# Altium project ATLAS_XP2V5.2016.11.14.PrjPcb (part 1 of 2)
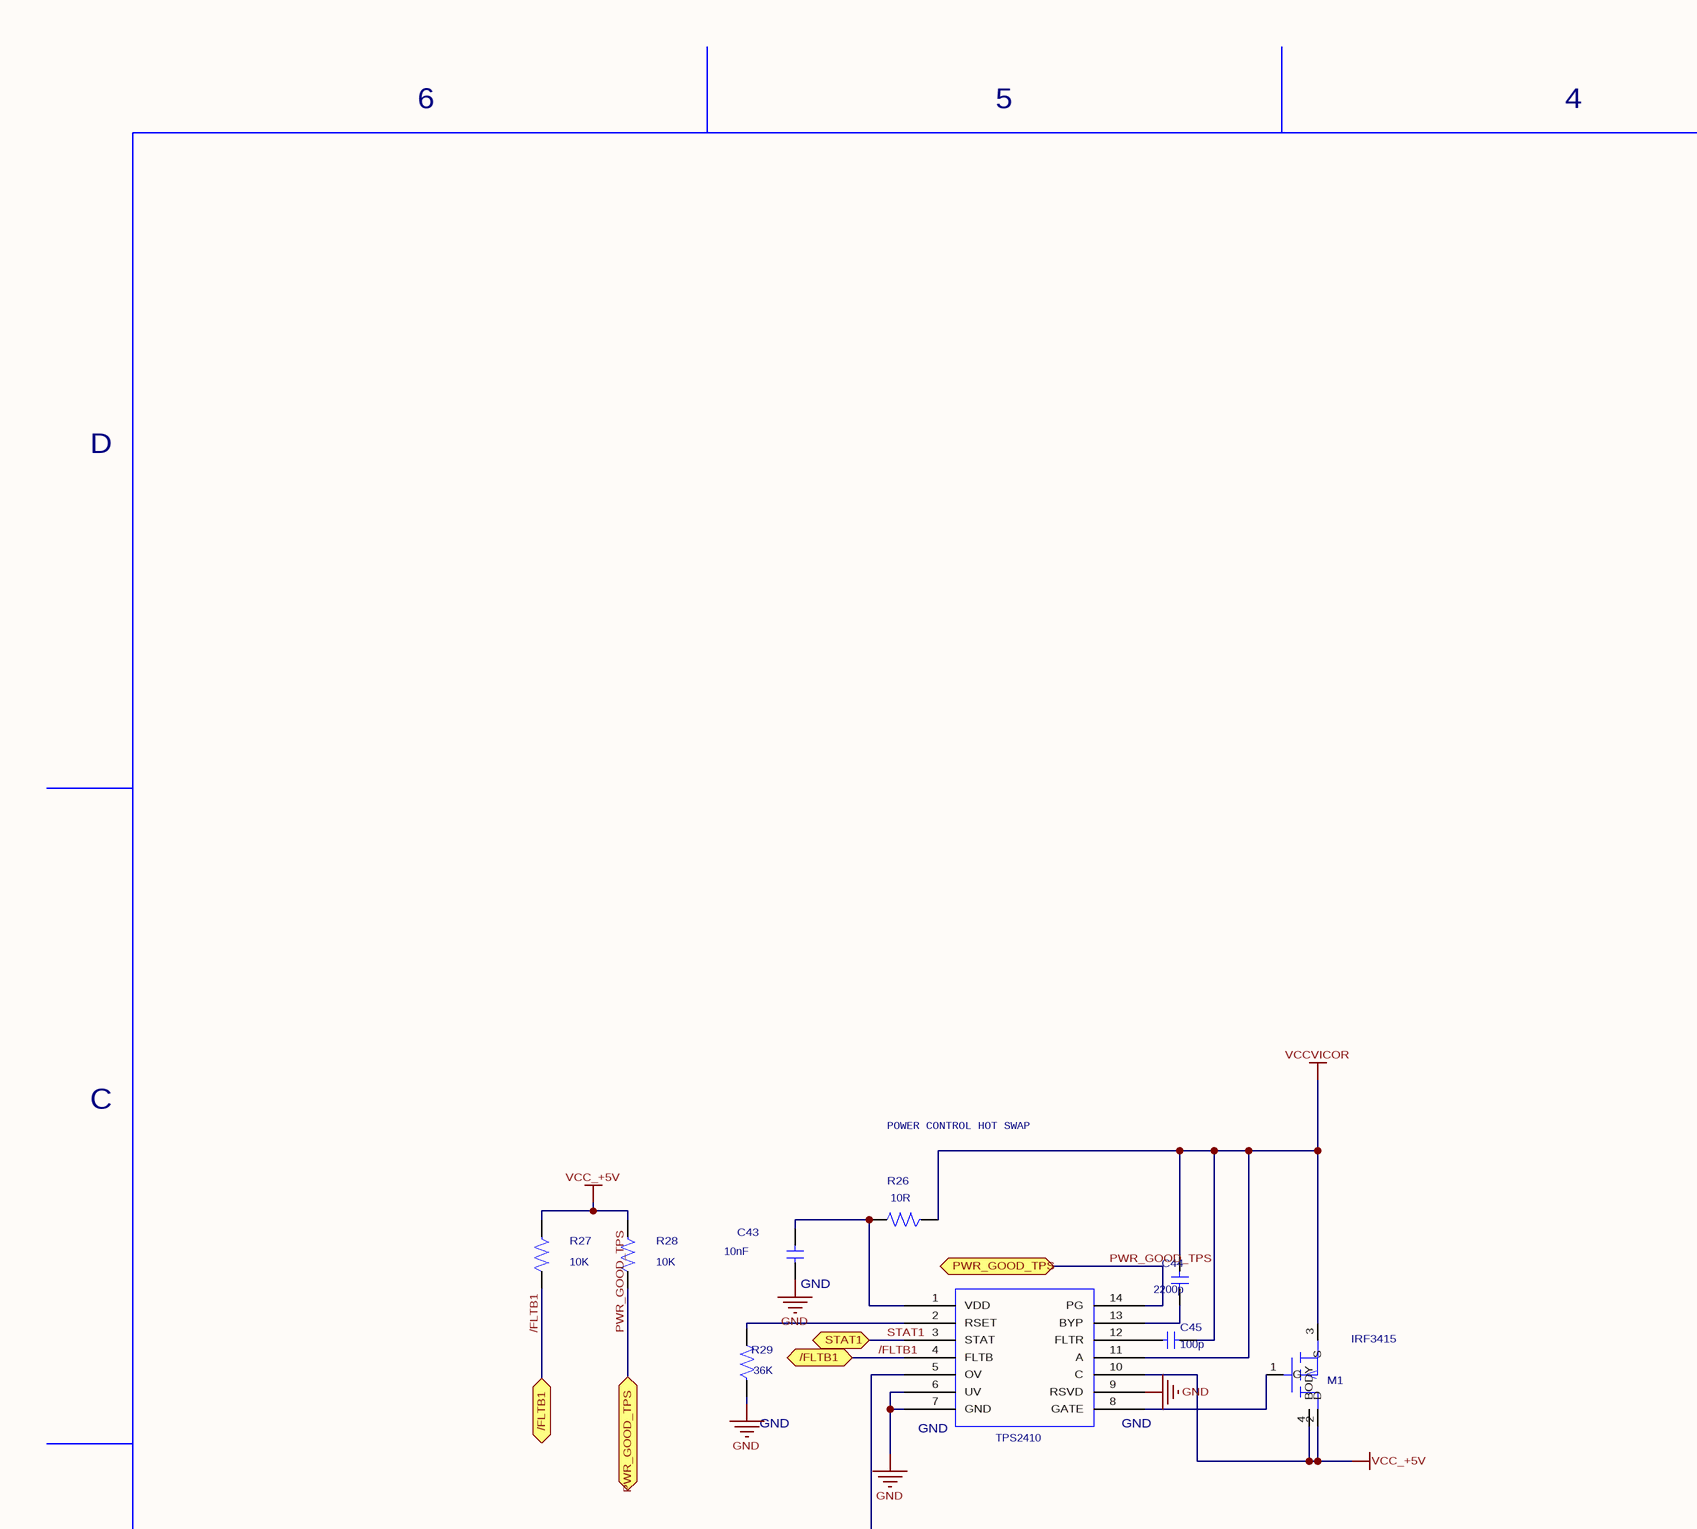
[diagram p0: POWER_SUPPLY.SchDoc, top left]
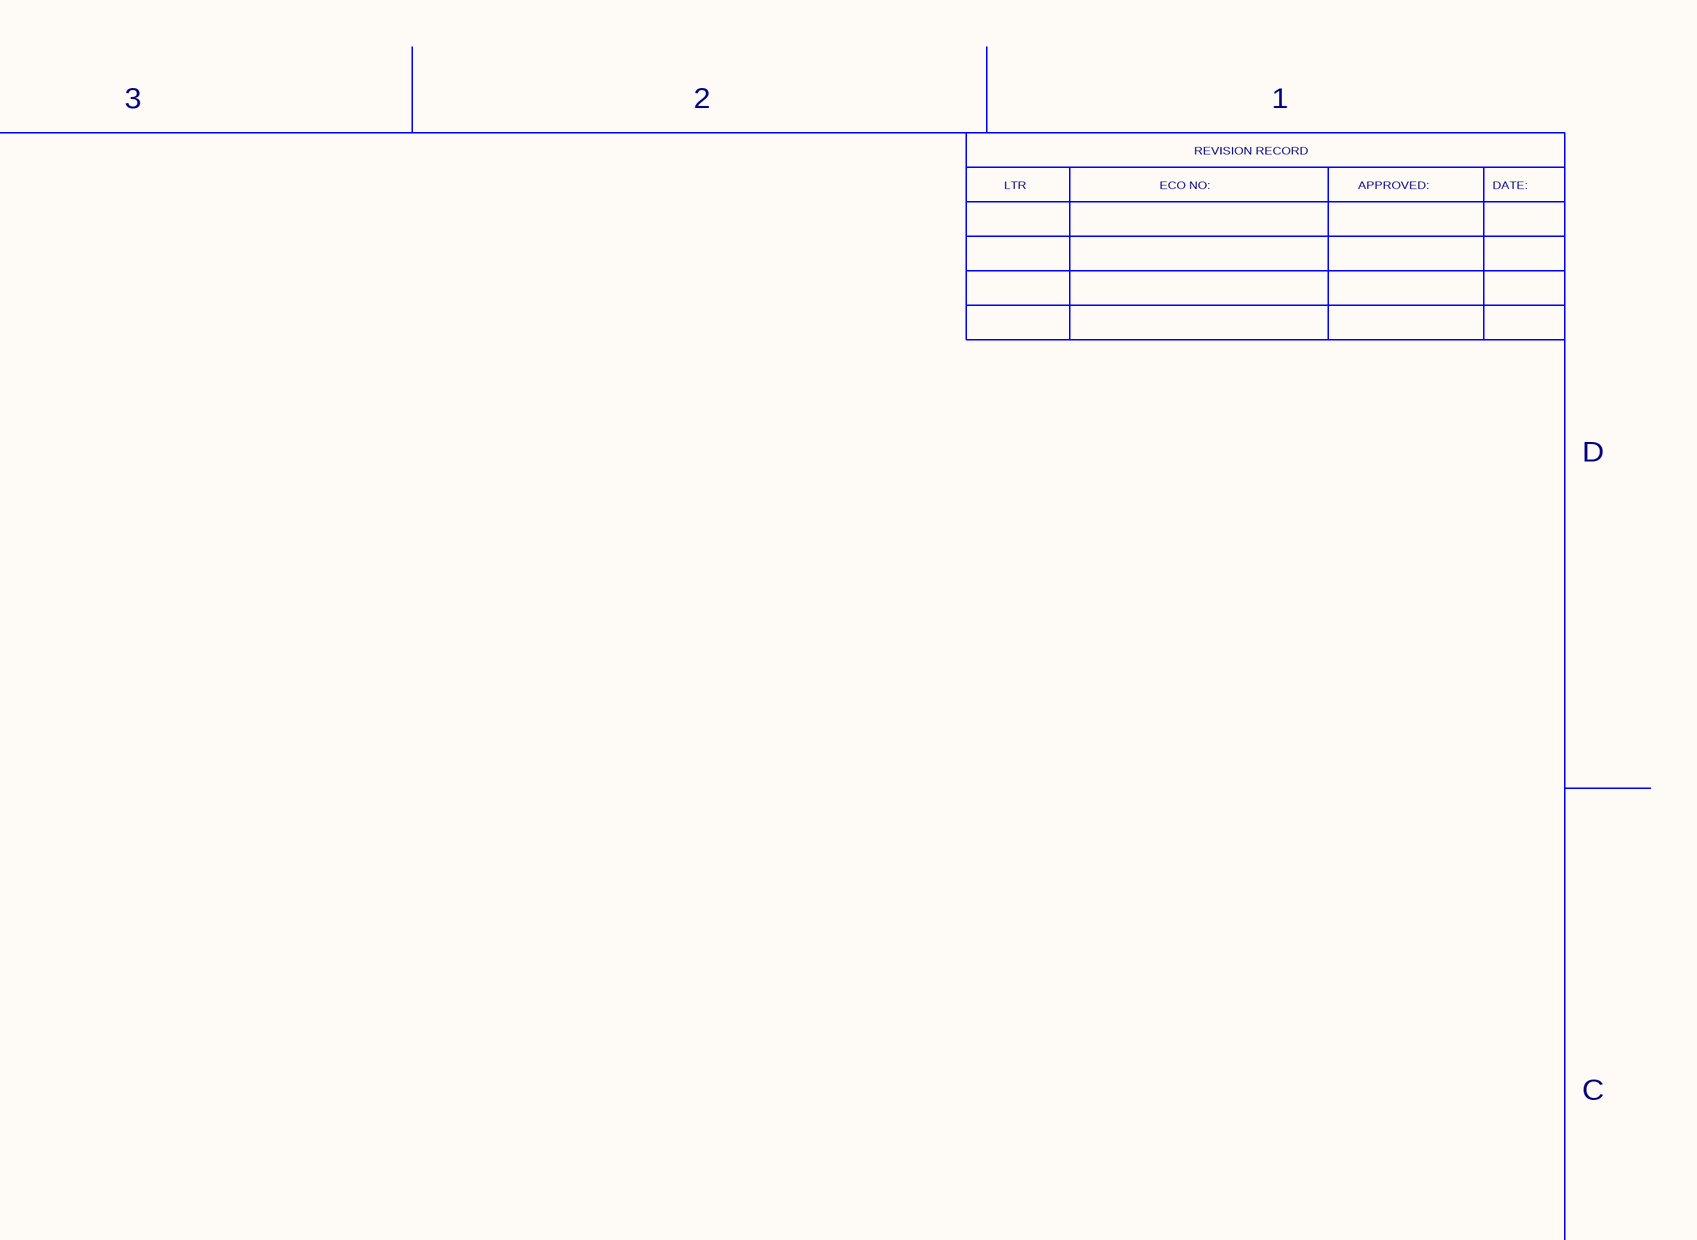
[diagram p1: POWER_SUPPLY.SchDoc, top right]
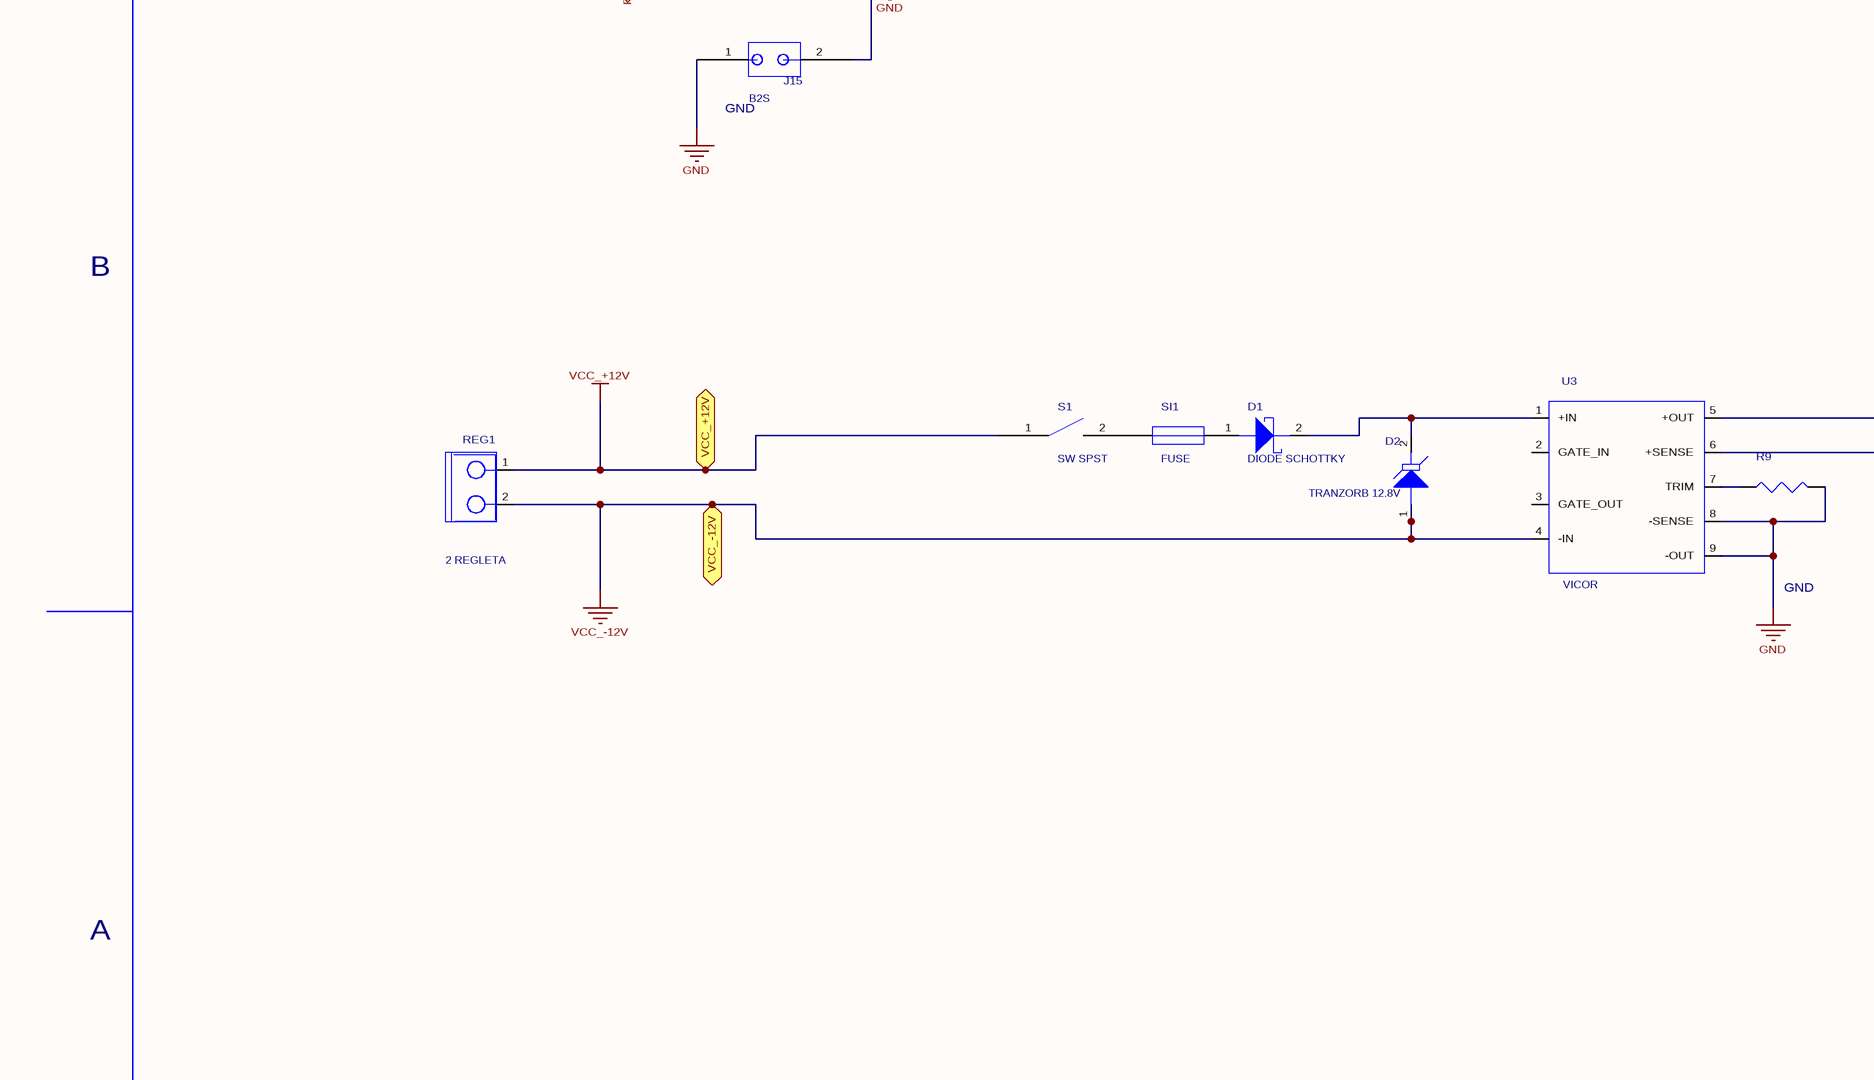
[diagram p2: POWER_SUPPLY.SchDoc, bottom left]
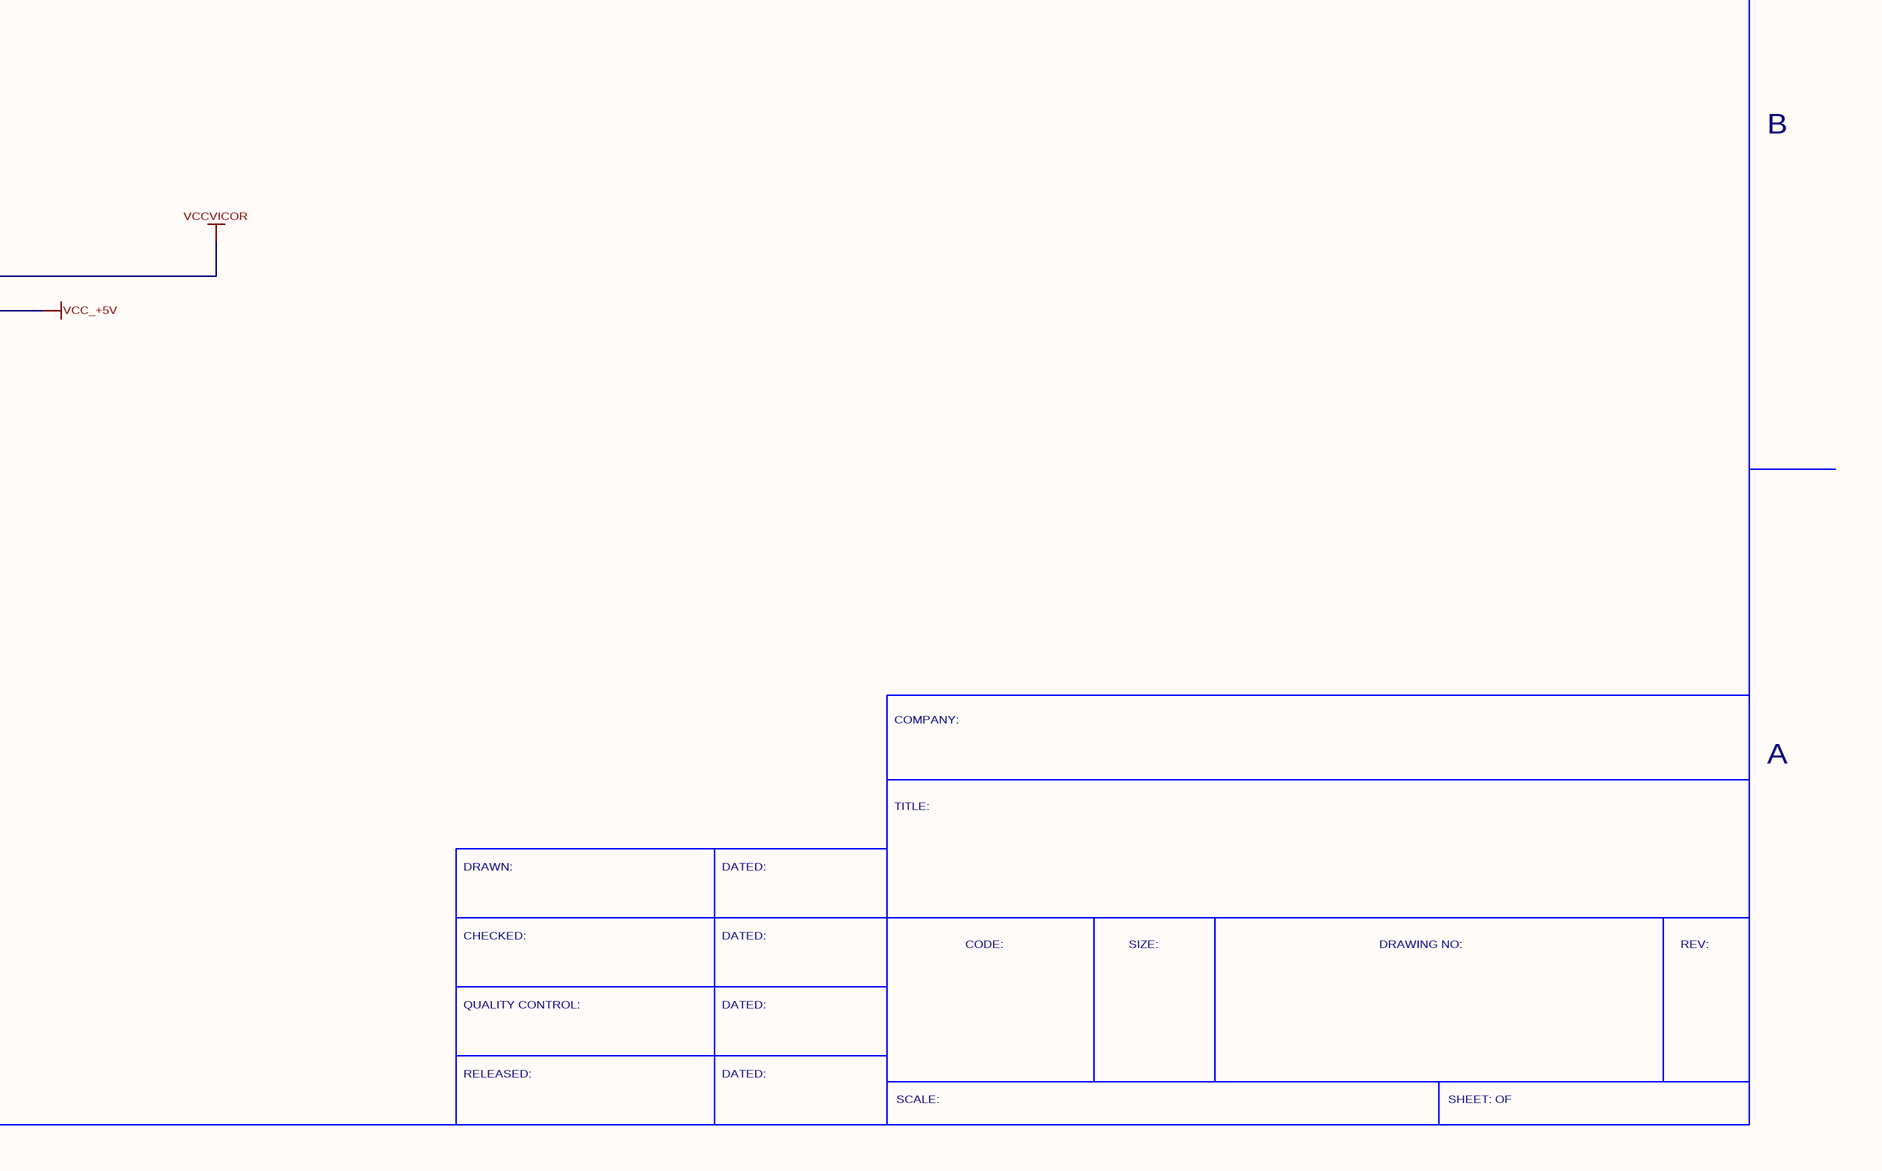
[diagram p3: POWER_SUPPLY.SchDoc, bottom right]
6 sheets, 150 parts. Net scope: flat (ports and power ports of the same name join across sheets).
Board file: ATLAS_XP2V5.2016.11.14_BACKUP.PcbDoc
Sheets:
  POWER_SUPPLY.SchDoc
  WDT_TASTERI_M_S.SchDoc
  MAX_BUS.SchDoc
  PROBA.SchDoc
  ATLAS_XP2V5.Sheet 5.SchDoc
  ISA_XILINX.SchDoc

## Sheet POWER_SUPPLY.SchDoc: ATLAS_XP2V5
size 558 x 431 mm; Organization: IMP Automatika d.o.o.; Revision: V5

### Parts
C43  value 10nF  [SM/C_0805]  (hidden comment: C_3)
C44  value 2200p  [SM/C_0805]  (hidden comment: C_3)
C45  value 100p  [SM/C_0805]  (hidden comment: C_3)
D1  value DIODE SCHOTTKY  [SM/DO214AB_21]  (hidden comment: DIODE_SCHOTTKY_0)
D2  value TRANZORB 12.8V  [SM/DO214AC_21]  (hidden comment: TRANZORB_0)
J15  value B2S  [JUMPER_100]  (hidden comment: B2S_0)
M1  value IRF3415  [IRF3415_PADS_REV1]  (hidden comment: IRF3415_BODY)
R9  RESISTOR  [SM/R_1206]  (value not drawn)
R26  value 10R  [SM/R_1206]  (hidden comment: R)
R27  value 10K  [SM/R_1206]  (hidden comment: R)
R28  value 10K  [SM/R_1206]  (hidden comment: R)
R29  value 36K  [SM/R_1206]  (hidden comment: R)
REG1  value 2 REGLETA  [REG2_REV8]  (hidden comment: 8_REGLETA_4)
S1  value SW SPST  [SW12V_REV2]  (hidden comment: SW_SPST_0)
SI1  FUSE  [FUSEHOLDER3]
U3  VICOR  [VIKOR1]
U14  value TPS2410  [PDSO-G14_REV7]  (hidden comment: TPS2410_1)

### Ports
/FLTB1 (bidir), PWR_GOOD_TPS (bidir), STAT1 (bidir), VCC_+12V (bidir), VCC_-12V (bidir)

### Nets
GND: C43.1 J15.1 R9.2 R29.1 U3.8(-SENSE) U3.9(-OUT) U14.6(UV) U14.7(GND) U14.9(RSVD)
VCC_+5V: M1.2(D) M1.4(BODY) R27.1 R28.1 U3.6(+SENSE) U14.10(C)  [project net DATA_MAX_BUS12]
VCC_+12V: REG1.1 S1.1(COMMON) ; port VCC_+12V
VCC_-12V: D2.1(ANODE) REG1.2 U3.4(-IN) ; port VCC_-12V
VCCVICOR: C44.2 C45.1 M1.3(S) R26.1 U3.5(+OUT) U14.11(A)
/FLTB1: R27.2 U14.4(FLTB) ; port /FLTB1
PWR_GOOD_TPS: R28.2 U14.14(PG) ; port PWR_GOOD_TPS
STAT1: U14.3(STAT) ; port STAT1
NetC43_2: C43.2 R26.2 U14.1(VDD)
NetC44_1: C44.1 U14.13(BYP)
NetC45_2: C45.2 U14.12(FLTR)
NetD1_1: D1.1(ANODE) SI1.2
NetD1_2: D1.2(CATHODE) D2.2(CATHODE) U3.1(+IN)
NetJ15_2: J15.2 U14.5(OV)
NetM1_1: M1.1(G) U14.8(GATE)
NetR9_1: R9.1 U3.7(TRIM)
NetR29_2: R29.2 U14.2(RSET)
NetS1_2: S1.2(NO) SI1.1

Not connected (* = marked no-connect by the designer): U3 2(GATE_IN) 3(GATE_OUT)

### Notes on the sheet
- 6
- 5
- 4
- 3
- 2
- 1
- LTR
- ECO NO:
- REVISION RECORD
- APPROVED:
- DATE:
- D
- C
- POWER CONTROL HOT SWAP
- (near C43) GND
- (near R29) GND
- (near U14) GND
- (near J15) GND
- B
- GND
- COMPANY:
- A
- TITLE:
- DRAWN:
- DATED:
- CHECKED:
- CODE:
- SIZE:
- DRAWING NO:
- REV:
- QUALITY CONTROL:
- RELEASED:
- SCALE:
- SHEET: OF

### Library data of the parts
C43 = C_3: COMPSIDE: TOP; COMPLOC: [-4300.000,200.000]; COMPROT: 0; COMPFIXED: NO; COMPHEIGHT: 0.000; Source_Path: C:\ORCAD\ORCAD_10.0\TOOLS\CAPTURE\LIBRARY\PSPICE\ANALOG.OLB; DIST: FLAT; PSpiceTemplate: C^@REFDES %1 %2 ?TOLERANCE|C^@REFDES| @VALUE ?IC/IC=@IC/ ?TOLERANCE|\n.model C^@REFDES CAP C=1 DEV=@TOLERANCE%|; VOLTAGE: CMAX; CURRENT: CIMAX; KNEE: CBMAX; SLOPE: CSMAX; MAX_TEMP: CTMAX; COMPGROUP: 0; COMPLOCKED: NO; COMPKEY: NO; DECOUPLER: NO; MEMORY: NO; PCB DECAL: SM/C_0805
C44 = C_3: COMPSIDE: TOP; COMPLOC: [-3400.000,200.000]; COMPROT: 0; COMPFIXED: NO; COMPHEIGHT: 0.000; Source_Path: C:\ORCAD\ORCAD_10.0\TOOLS\CAPTURE\LIBRARY\PSPICE\ANALOG.OLB; DIST: FLAT; PSpiceTemplate: C^@REFDES %1 %2 ?TOLERANCE|C^@REFDES| @VALUE ?IC/IC=@IC/ ?TOLERANCE|\n.model C^@REFDES CAP C=1 DEV=@TOLERANCE%|; VOLTAGE: CMAX; CURRENT: CIMAX; KNEE: CBMAX; SLOPE: CSMAX; MAX_TEMP: CTMAX; PCB DECAL: SM/C_0805; COMPGROUP: 0; COMPLOCKED: NO; COMPKEY: NO; DECOUPLER: NO; MEMORY: NO
C45 = C_3: COMPHEIGHT: 0.000; MEMORY: NO; COMPGROUP: 0; COMPLOC: [-3700.000,200.000]; COMPSIDE: TOP; Source_Path: C:\ORCAD\ORCAD_10.0\TOOLS\CAPTURE\LIBRARY\PSPICE\ANALOG.OLB; DIST: FLAT; PSpiceTemplate: C^@REFDES %1 %2 ?TOLERANCE|C^@REFDES| @VALUE ?IC/IC=@IC/ ?TOLERANCE|\n.model C^@REFDES CAP C=1 DEV=@TOLERANCE%|; VOLTAGE: CMAX; CURRENT: CIMAX; KNEE: CBMAX; SLOPE: CSMAX; MAX_TEMP: CTMAX; DECOUPLER: NO; COMPKEY: NO; COMPLOCKED: NO; COMPFIXED: NO; COMPROT: 0; PCB DECAL: SM/C_0805
D1 = DIODE_SCHOTTKY_0: Source_Path: C:\CADENCE\PSD_15.1\TOOLS\ATLAS_ITA\ATLAS_ITA.DSN; PCB DECAL: SM/DO214AB_21
D2 = TRANZORB_0: Source_Path: C:\CADENCE\PSD_15.1\TOOLS\ATLAS_ITA\ATLAS_ITA.DSN; PCB DECAL: SM/DO214AC_21
J15 = B2S_0: Source_Path: C:\CADENCE\PSD_15.1\TOOLS\ATLAS_ITA\ATLAS_ITA.DSN; PCB DECAL: JUMPER_100
M1 = IRF3415_BODY: COMPSIDE: TOP; COMPLOC: [-1200.000,2000.000]; COMPROT: 0; COMPFIXED: NO; COMPHEIGHT: 0.000; Source_Path: C:\CADENCE\PSD_15.1\TOOLS\ATLAS_ITA\ATLAS_ITA.DSN; PSpiceTemplate: M^@REFDES %d %g %s %s @MODEL; COMPGROUP: 0; COMPLOCKED: NO; COMPKEY: NO; DECOUPLER: NO; MEMORY: NO; Implementation: IRF3415; PCB DECAL: IRF3415_PADS_REV1
R9 = RESISTOR: Source_Path: C:\PROGRAM FILES\ORCAD\CAPTURE\LIBRARY\DISCRETE.OLB; PCB DECAL: SM/R_1206; Value: RESISTOR
R26 = R: COMPSIDE: TOP; COMPLOC: [-2400.000,2400.000]; COMPROT: 0; COMPFIXED: NO; COMPHEIGHT: 0.000; Source_Path: C:\ORCAD\ORCAD_10.0\TOOLS\CAPTURE\LIBRARY\PSPICE\ANALOG.OLB; DIST: FLAT; PSpiceTemplate: R^@REFDES %1 %2 ?TOLERANCE|R^@REFDES| @VALUE  ?TOLERANCE|\n.model R^@REFDES RES R=1 DEV=@TOLERANCE%|; VOLTAGE: RVMAX; SLOPE: RSMAX; MAX_TEMP: RTMAX; POWER: RMAX; COMPGROUP: 0; COMPLOCKED: NO; COMPKEY: NO; DECOUPLER: NO; MEMORY: NO; PCB DECAL: SM/R_1206
R27 R28 = R: Source_Path: C:\ORCAD\ORCAD_10.0\TOOLS\CAPTURE\LIBRARY\PSPICE\ANALOG.OLB; DIST: FLAT; PSpiceTemplate: R^@REFDES %1 %2 ?TOLERANCE|R^@REFDES| @VALUE  ?TOLERANCE|\n.model R^@REFDES RES R=1 DEV=@TOLERANCE%|; VOLTAGE: RVMAX; SLOPE: RSMAX; MAX_TEMP: RTMAX; POWER: RMAX; PCB DECAL: SM/R_1206
R29 = R: COMPHEIGHT: 0.000; MEMORY: NO; COMPGROUP: 0; COMPLOC: [-2400.000,2400.000]; COMPSIDE: TOP; Source_Path: C:\ORCAD\ORCAD_10.0\TOOLS\CAPTURE\LIBRARY\PSPICE\ANALOG.OLB; DIST: FLAT; PSpiceTemplate: R^@REFDES %1 %2 ?TOLERANCE|R^@REFDES| @VALUE  ?TOLERANCE|\n.model R^@REFDES RES R=1 DEV=@TOLERANCE%|; VOLTAGE: RVMAX; SLOPE: RSMAX; MAX_TEMP: RTMAX; POWER: RMAX; DECOUPLER: NO; COMPKEY: NO; COMPLOCKED: NO; COMPFIXED: NO; COMPROT: 0; PCB DECAL: SM/R_1206
REG1 = 8_REGLETA_4: Source_Path: E:\MILOS\PROJECTS\ATLAS_XP\ATLAS_XP.DSN; SDTSourceLibName: C:\WINDOWS\TEMP\ATP_00.LIB; PCB DECAL: REG2_REV8
S1 = SW_SPST_0: Source_Path: C:\CADENCE\PSD_15.1\TOOLS\ATLAS_ITA\ATLAS_ITA.DSN; PCB DECAL: SW12V_REV2
SI1 = FUSE: Source_Path: C:\CADENCE\PSD_15.1\TOOLS\CAPTURE\LIBRARY\IEC\DEVICE.OLB; PCB DECAL: FUSEHOLDER3; Value: FUSE
U3 = VICOR: Source_Path: C:\DOCUMENTS AND SETTINGS\RAYVOJ HARDWAREA\DESKTOP\MILOSH.OLB; PCB DECAL: VIKOR1; Value: VICOR
U14 = TPS2410_1: FPLIST: DIP.100B/14/W.300/L.800; COMPSIDE: TOP; COMPLOC: [-700.000,900.000]; COMPROT: 0; COMPFIXED: NO; COMPHEIGHT: 0.000; Source_Path: C:\ORCAD\PROJECTS\PUPINATPPCB.DSN; PCB DECAL: PDSO-G14_REV7; COMPGROUP: 0; COMPLOCKED: NO; COMPKEY: NO; DECOUPLER: NO; MEMORY: NO

## Sheet WDT_TASTERI_M_S.SchDoc: ATLAS_XP2V5
size 558 x 431 mm; Organization: IMP Automatika d.o.o.; Revision: V5
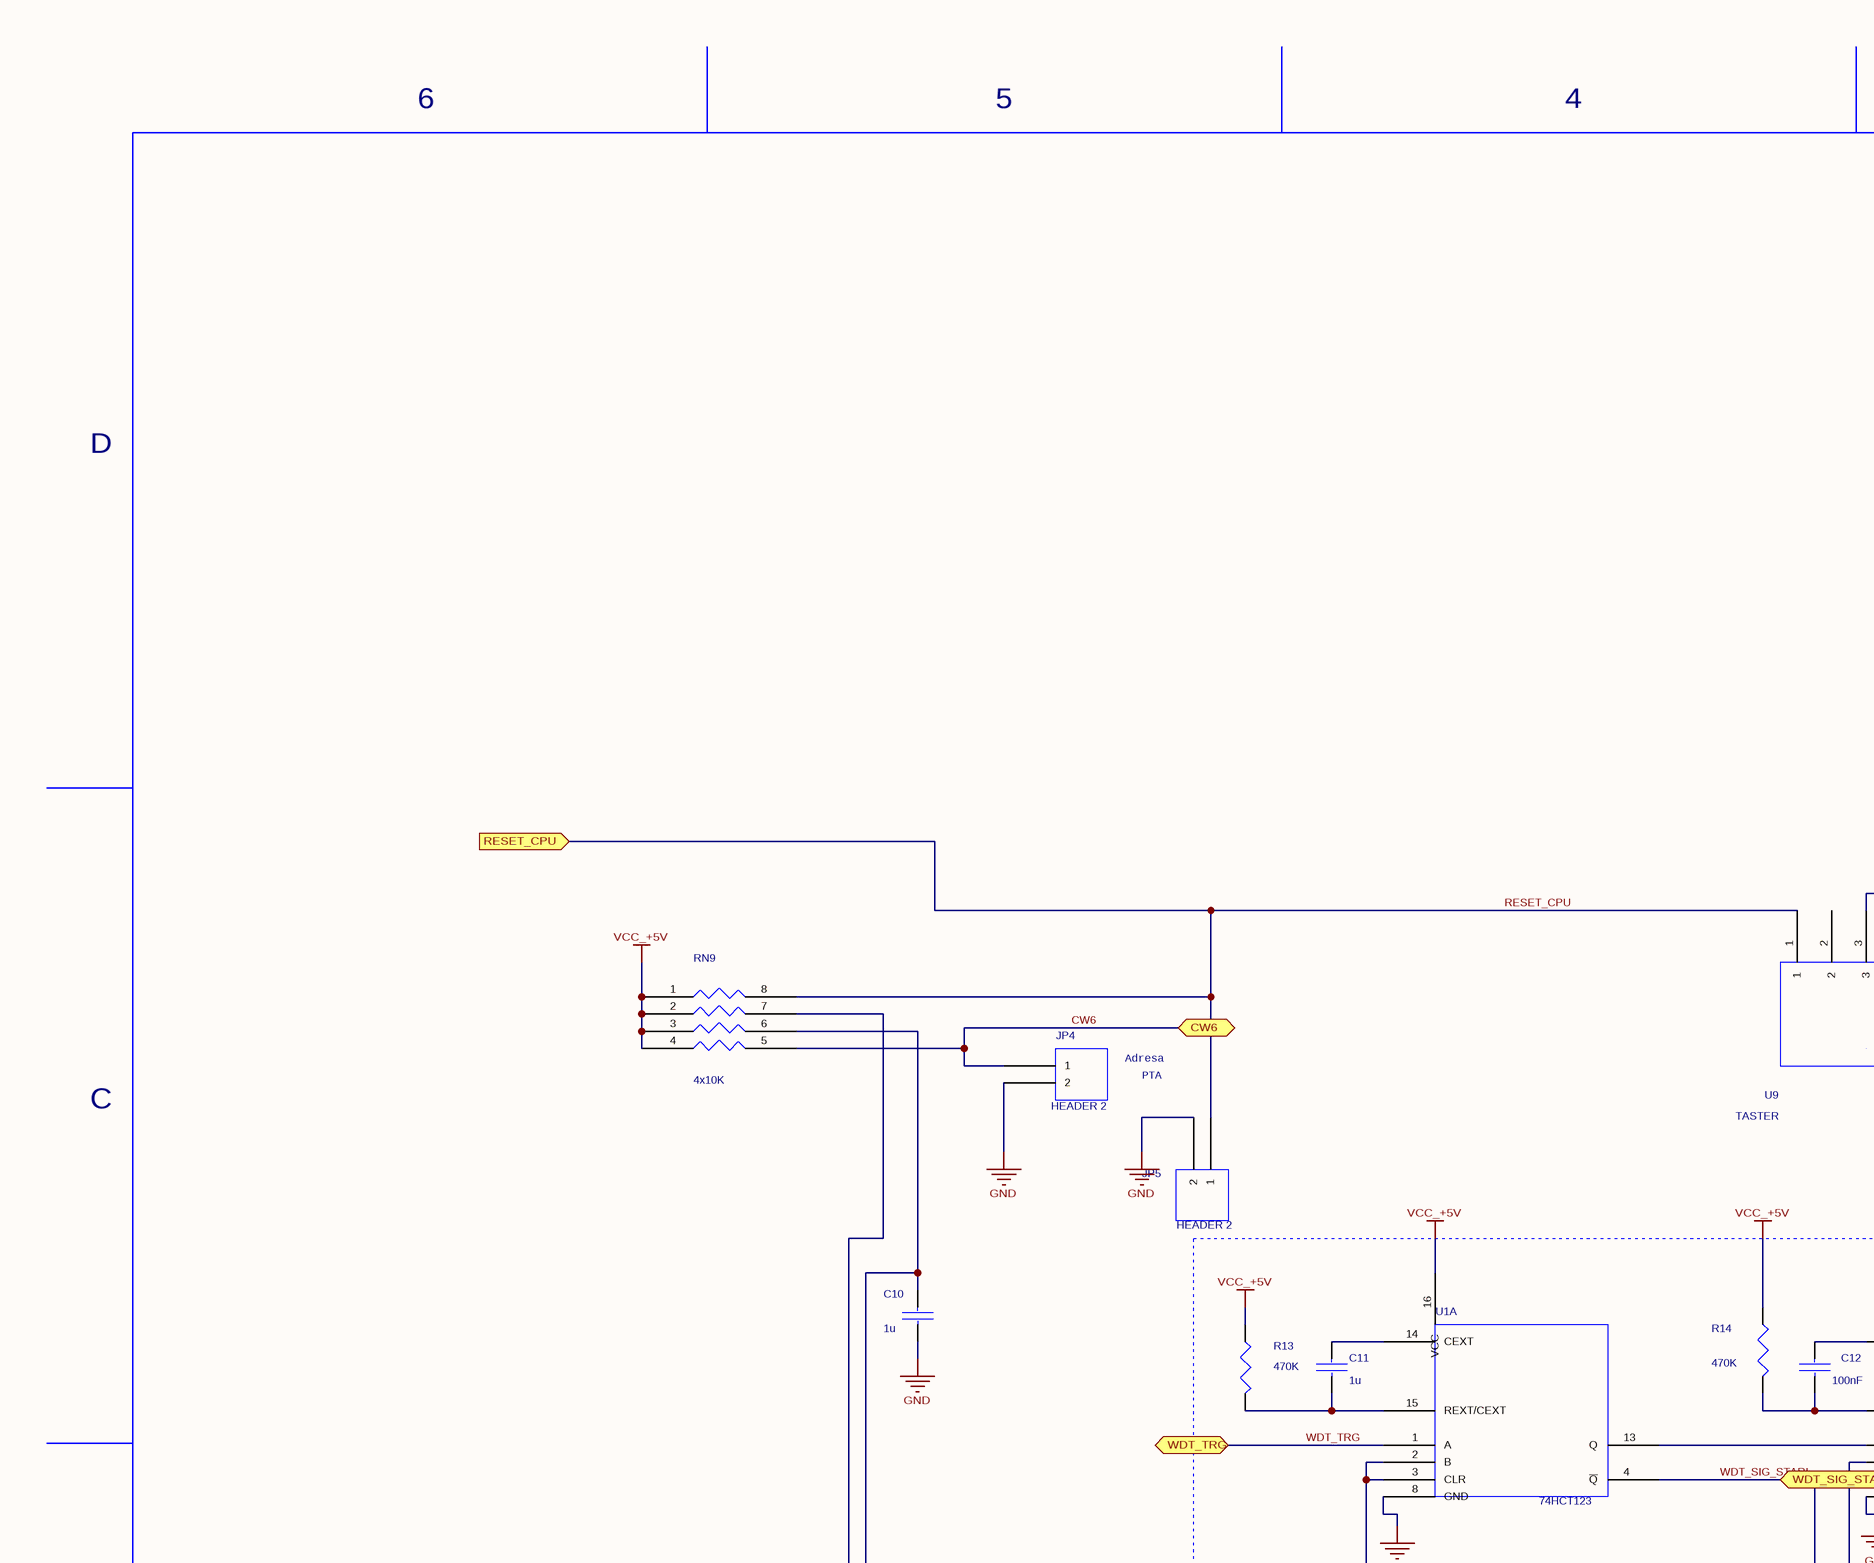
[diagram p4: WDT_TASTERI_M_S.SchDoc, top left]
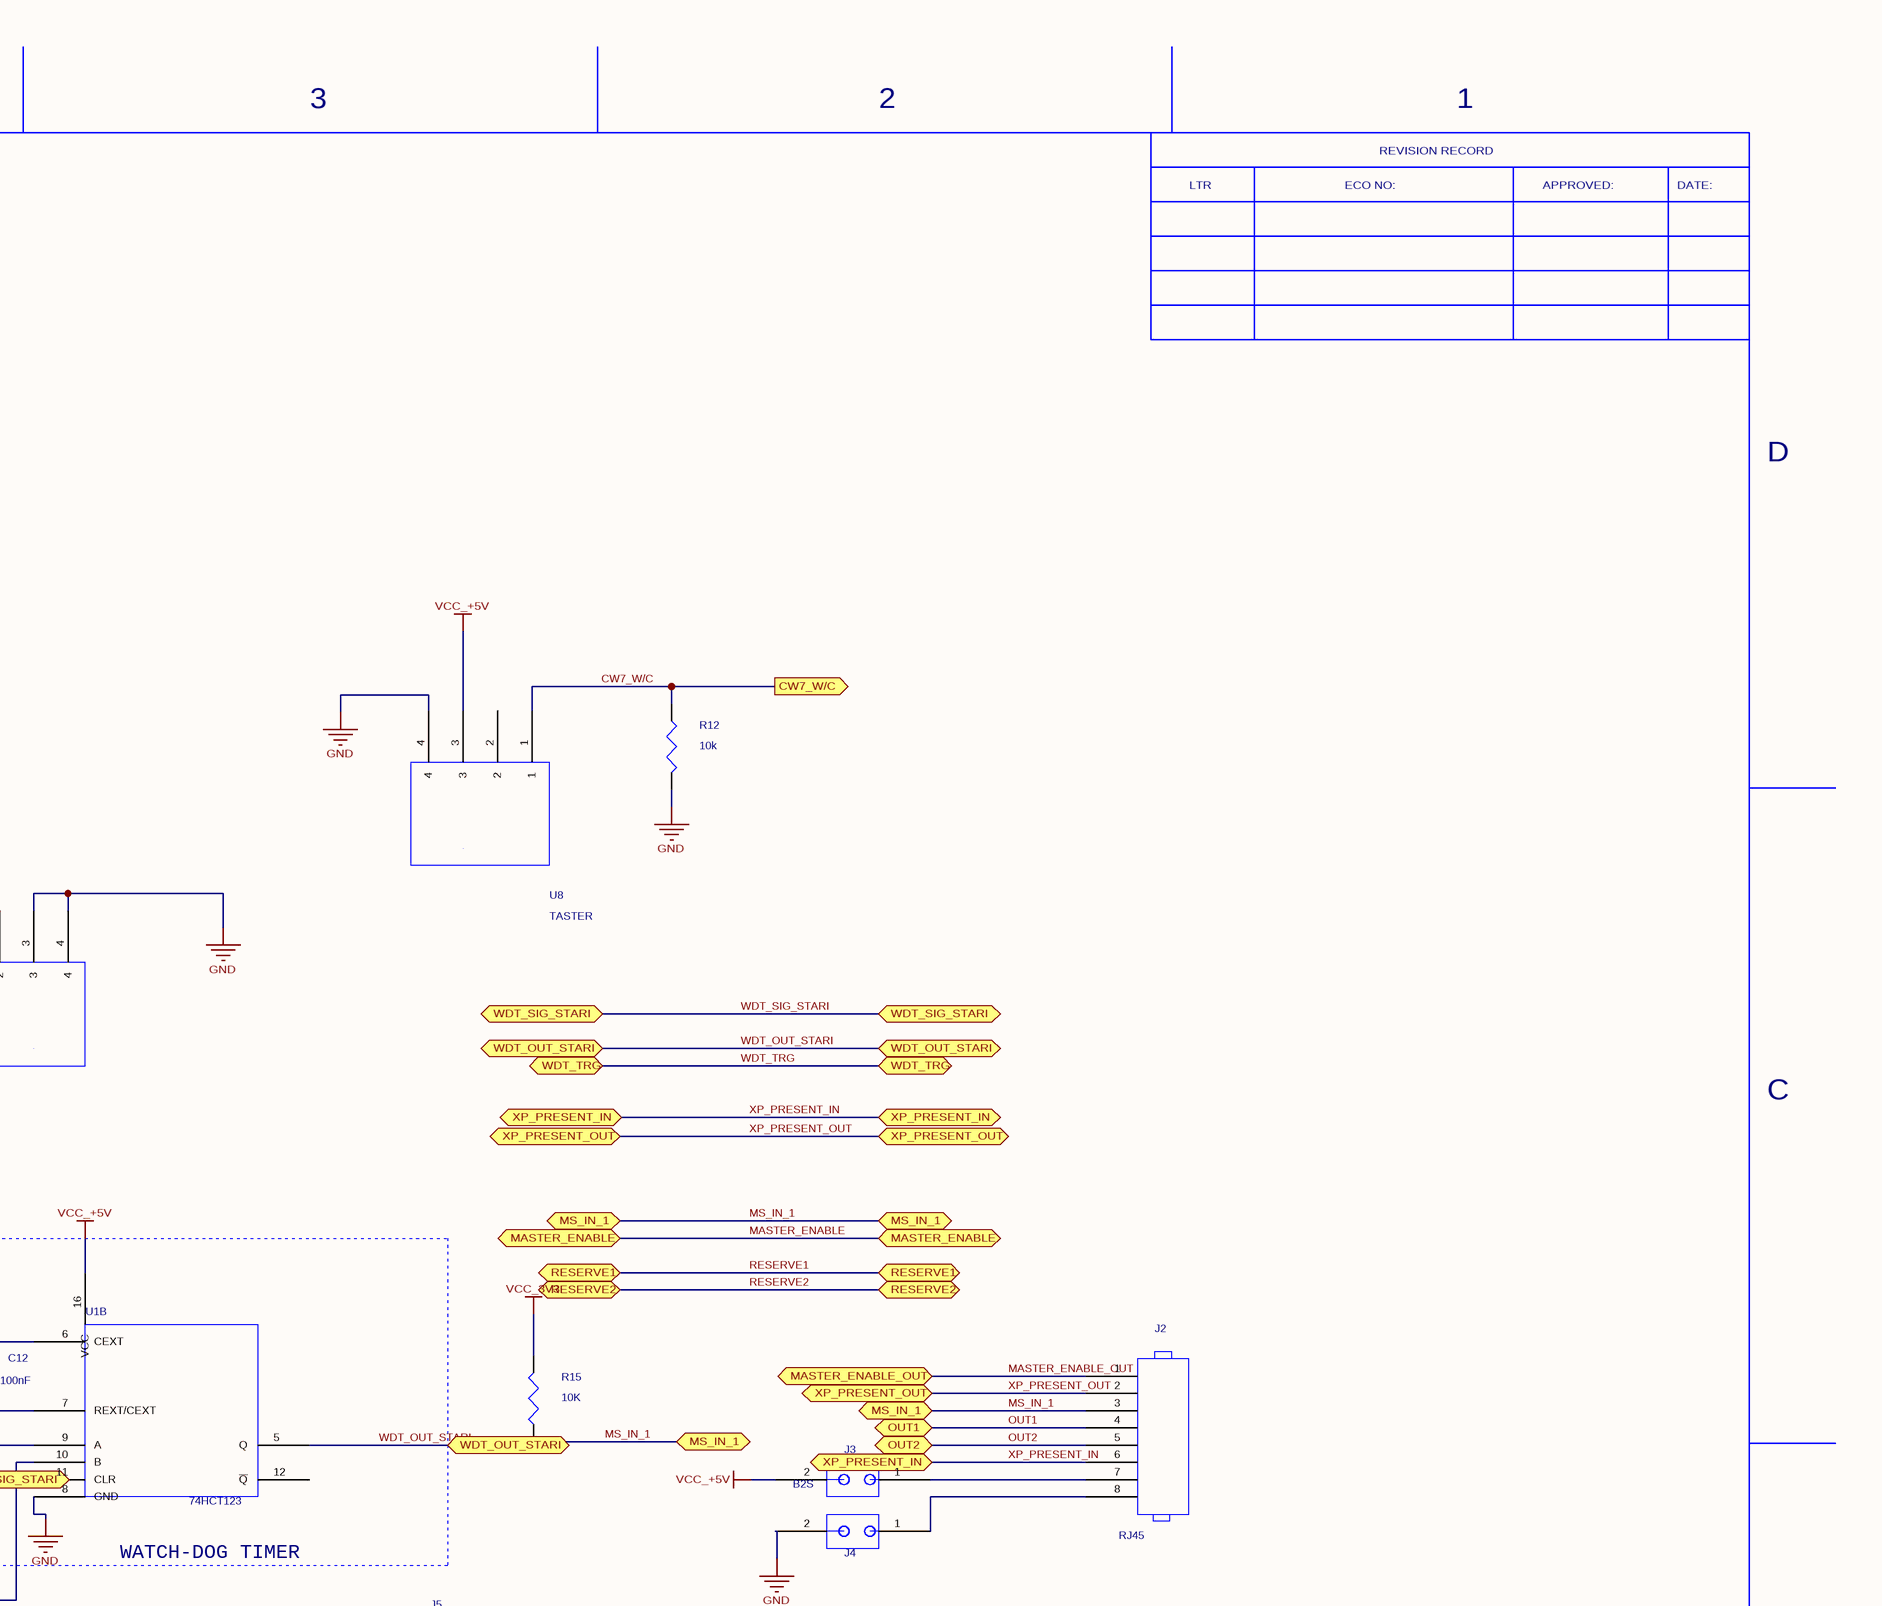
[diagram p5: WDT_TASTERI_M_S.SchDoc, top right]
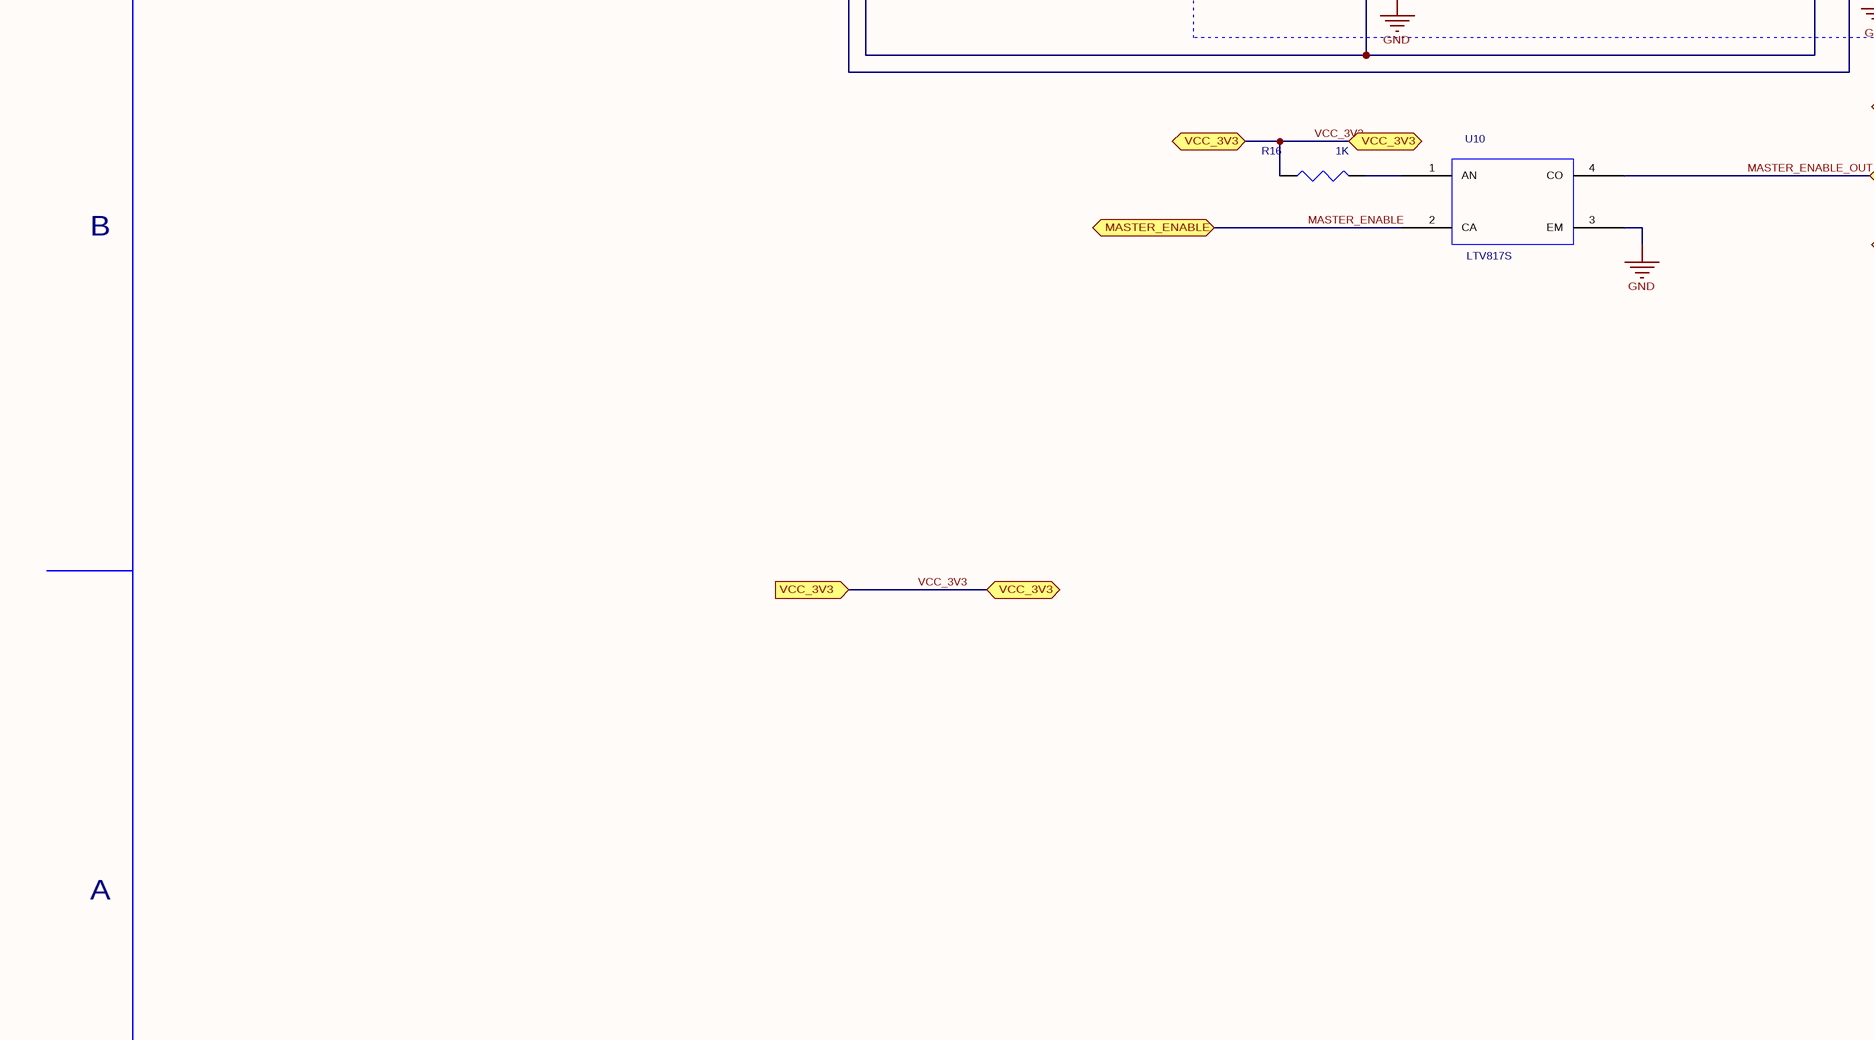
[diagram p6: WDT_TASTERI_M_S.SchDoc, bottom left]
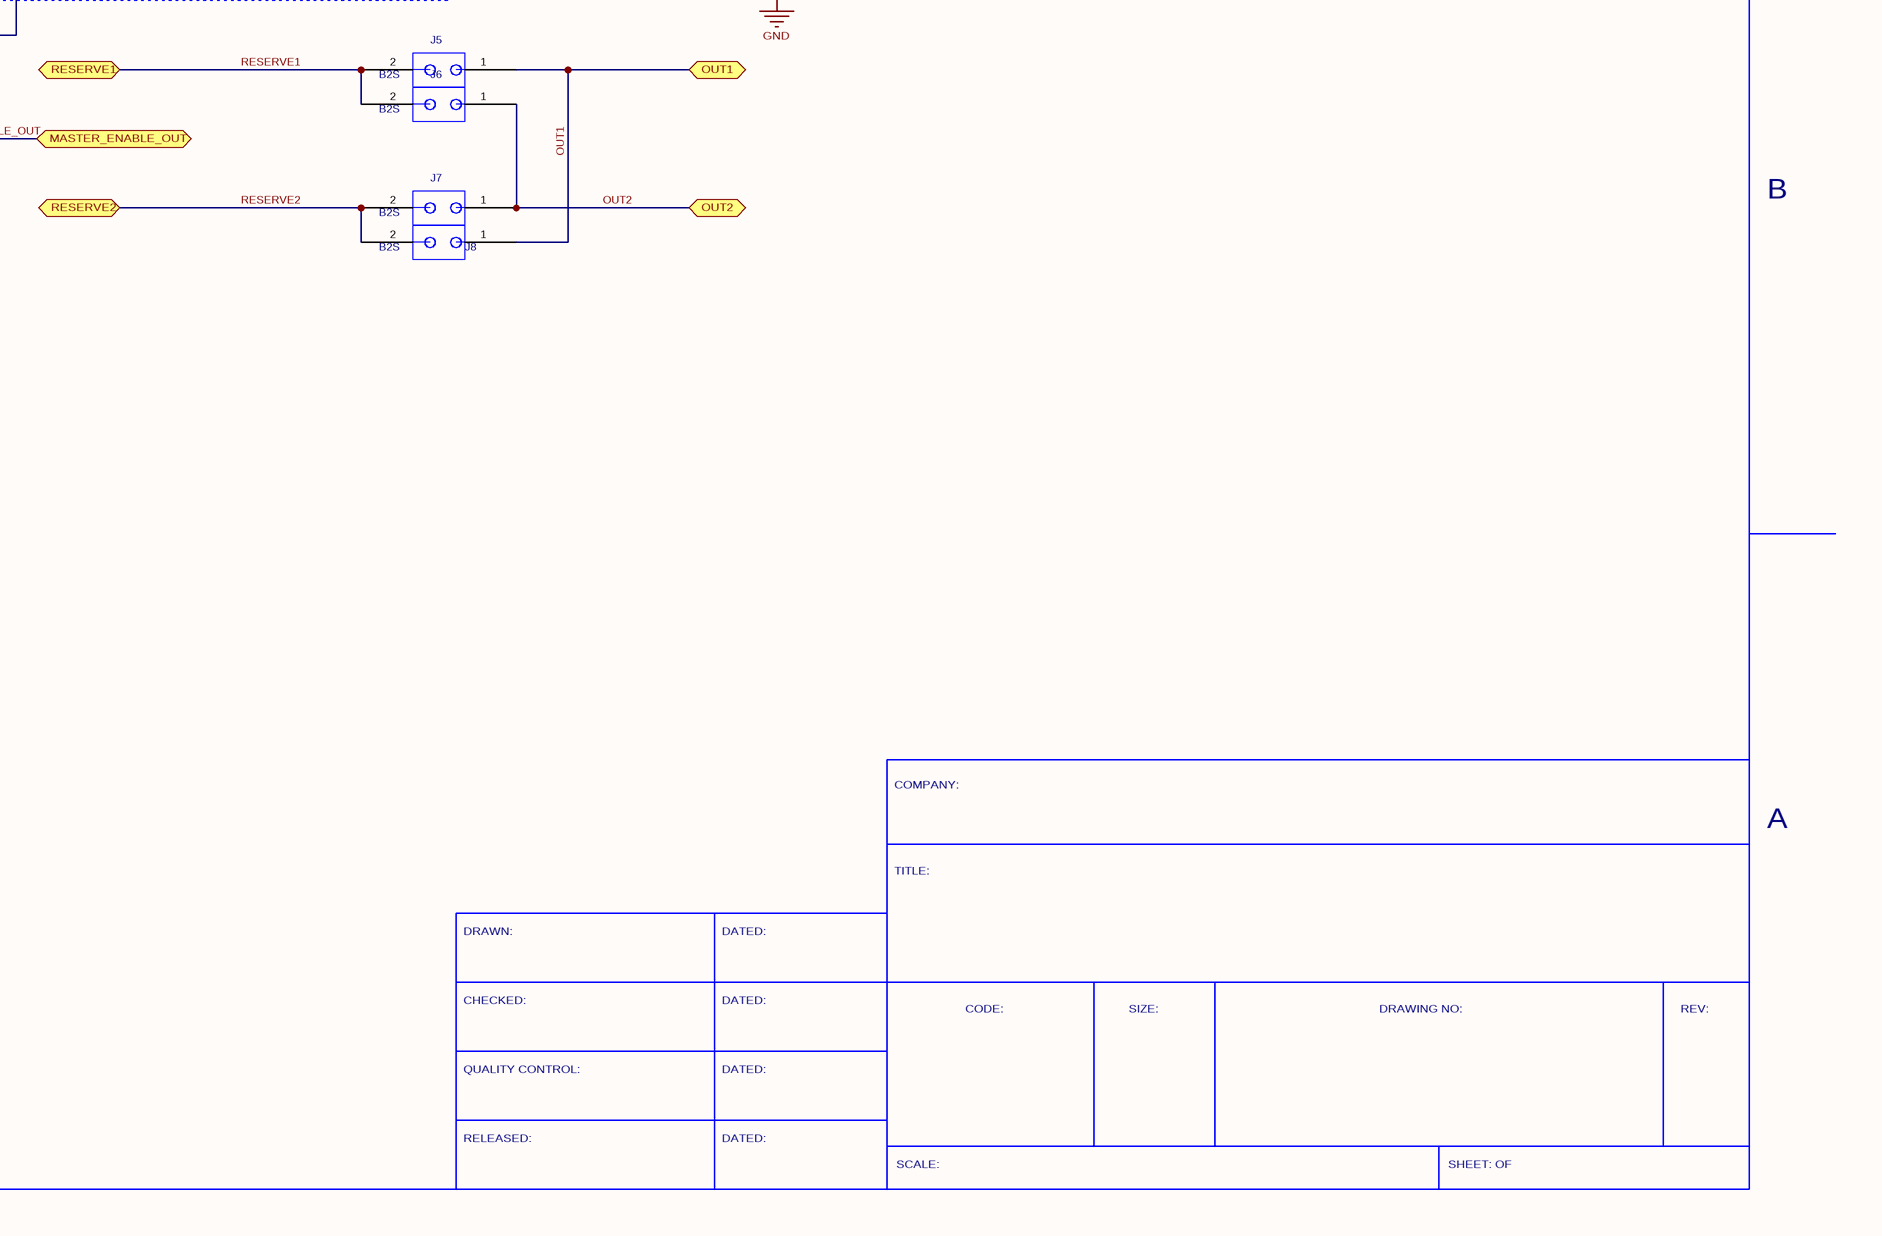
[diagram p7: WDT_TASTERI_M_S.SchDoc, bottom right]

### Parts
C10  value 1u  [SM/C_0805]  (hidden comment: C_2)
C11  value 1u  [SM/C_0805]  (hidden comment: C_2)
C12  value 100nF  [SM/C_0805]  (hidden comment: C_2)
J2  value RJ45  [TELE/TM.420FACE/8X8]  (hidden comment: 8_HEADER)
J3  value B2S  [JUMPER_100]  (hidden comment: B2S_0)
J4  B2S_0  [JUMPER_100]  (value not drawn)
J5  value B2S  [JUMPER_100]  (hidden comment: B2S_0)
J6  value B2S  [JUMPER_100]  (hidden comment: B2S_0)
J7  value B2S  [JUMPER_100]  (hidden comment: B2S_0)
J8  value B2S  [JUMPER_100]  (hidden comment: B2S_0)
JP4  value HEADER 2  [JUMPER_100]  (hidden comment: HEADER_2)
JP5  value HEADER 2  [JUMPER_100]  (hidden comment: HEADER_2)
R12  value 10k  [SM/R_1206]  (hidden comment: RESISTOR_2)
R13  value 470K  [SM/R_1206]  (hidden comment: RESISTOR_2)
R14  value 470K  [SM/R_1206]  (hidden comment: RESISTOR_2)
R15  value 10K  [SM/R_1206]  (hidden comment: RESISTOR_2)
R16  value 1K  [SM/R_1206]  (hidden comment: RESISTOR_2)
RN9  value 4x10K  [SMD_RX4]  (hidden comment: RESAR_IS_4/SM)
U1  value 74HCT123  [SOG.050/16/WG.244/L.375]  (hidden comment: 74HCT123_1)  (parts A,B of 2)
U8  value TASTER  [TP33WW080-SPST_PADS]  (hidden comment: SWITCH_BOJKE)
U9  value TASTER  [TP33WW080-SPST_PADS]  (hidden comment: SWITCH_BOJKE)
U10  value LTV817S  [LTV814S]  (hidden comment: LTV-817)

### Blocks framed on the sheet
WATCH-DOG TIMER: C11 C12 R13 R14 U1

### Ports
CW6 (bidir), CW7_W/C, MASTER_ENABLE (bidir), MASTER_ENABLE_OUT (bidir), MS_IN_1 (bidir), OUT1 (bidir), OUT2 (bidir), RESERVE1 (bidir), RESERVE2 (bidir), RESET_CPU, VCC_3V3, VCC_3V3 (bidir), WDT_OUT_STARI (bidir), WDT_SIG_STARI (bidir), WDT_TRG (bidir), XP_PRESENT_IN (bidir), XP_PRESENT_OUT (bidir)

### Nets
GND: C10.2 J4.2 JP4.2 JP5.2 R12.2 U1.8(GND) U8.4 U9.3 U9.4 U10.3(EM)
VCC_3V3: R15.2 R16.1 ; port VCC_3V3
VCC_+5V: J3.2 R13.1 R14.1 RN9.1 RN9.2 RN9.3 RN9.4 U1.16(VCC) U8.3  [project net DATA_MAX_BUS12]
CW6: JP4.1 RN9.5 ; port CW6
CW7_W/C: R12.1 U8.1 ; port CW7_W/C
MASTER_ENABLE: U10.2(CA) ; port MASTER_ENABLE
MASTER_ENABLE_OUT: J2.1 U10.4(CO) ; port MASTER_ENABLE_OUT
MS_IN_1: J2.3 R15.1 ; port MS_IN_1
OUT1: J2.4 J5.1 J8.1 ; port OUT1
OUT2: J2.5 J6.1 J7.1 ; port OUT2
RESERVE1: J5.2 J6.2 ; port RESERVE1
RESERVE2: J7.2 J8.2 ; port RESERVE2
RESET_CPU: JP5.1 RN9.8 U9.1 ; port RESET_CPU
WDT_OUT_STARI: U1.5(Q) ; port WDT_OUT_STARI
WDT_SIG_STARI: U1.4(~{Q}) ; port WDT_SIG_STARI
WDT_TRG: U1.1(A) ; port WDT_TRG
XP_PRESENT_IN: J2.6 ; port XP_PRESENT_IN
XP_PRESENT_OUT: J2.2 ; port XP_PRESENT_OUT
NetC10_1: C10.1 RN9.6 U1.2(B) U1.3(CLR) U1.11(CLR)
NetC11_1: C11.1 U1.14(CEXT)
NetC11_2: C11.2 R13.2 U1.15(REXT/CEXT)
NetC12_1: C12.1 U1.6(CEXT)
NetC12_2: C12.2 R14.2 U1.7(REXT/CEXT)
NetJ2_7: J2.7 J3.1
NetJ2_8: J2.8 J4.1
NetR16_2: R16.2 U10.1(AN)
NetRN9_7: RN9.7 U1.10(B)
NetU1_9: U1.9(A) U1.13(Q)

Not connected (* = marked no-connect by the designer): U1 12(~{Q}); U8 2; U9 2

### Notes on the sheet
- 6
- 5
- 4
- 3
- 2
- 1
- LTR
- ECO NO:
- REVISION RECORD
- APPROVED:
- DATE:
- D
- Adresa
- C
- PTA
- B
- COMPANY:
- A
- TITLE:
- DRAWN:
- DATED:
- CHECKED:
- CODE:
- SIZE:
- DRAWING NO:
- REV:
- QUALITY CONTROL:
- RELEASED:
- SCALE:
- SHEET: OF

### Library data of the parts
C10-C12 = C_2: Source_Path: D:\ORCADWIN\CAPTURE\PTA\PC2A_00.OLB; SDTSourceLibName: C:\WINDOWS\TEMP\PC2A_00.LIB; PCB DECAL: SM/C_0805
J2 = 8_HEADER: Source_Path: C:\CADENCE\PSD_15.1\TOOLS\CAPTURE\LIBRARY\CONNECTOR.OLB; PCB DECAL: TELE/TM.420FACE/8X8
J3 J5-J8 = B2S_0: as J15 on sheet POWER_SUPPLY; PCB DECAL: JUMPER_100
J4 = B2S_0: Source_Path: C:\CADENCE\PSD_15.1\TOOLS\ATLAS_ITA\ATLAS_ITA.DSN; Value: B2S; PCB DECAL: JUMPER_100
JP4 JP5 = HEADER_2: Source_Path: D:\ORCADWIN\CAPTURE\PTA\PC2A_00.OLB; SDTSourceLibName: C:\WINDOWS\TEMP\PC2A_00.LIB; PCB DECAL: JUMPER_100
R12-R16 = RESISTOR_2: Source_Path: C:\CADENCE\PSD_15.1\TOOLS\CAPTURE\LIBRARY\DISCRETE.OLB; PCB DECAL: SM/R_1206
RN9 = RESAR_IS_4/SM: Source_Path: C:\ORCAD\ORCAD_10.5\TOOLS\CAPTURE\LIBRARY\DISCRETE.OLB; PCB DECAL: SMD_RX4
U1 = 74HCT123_1: Source_Path: E:\MILOS\PROJECTS\ATLAS_XP\ATLAS_XP.DSN; SDTSourceLibName: C:\WINDOWS\TEMP\PC2A_00.LIB; PCB DECAL: SOG.050/16/WG.244/L.375
U8 = SWITCH_BOJKE: CW_TASTER; Source_Path: C:\CADENCE\PSD_15.1\TOOLS\ATLAS_ITA\LIBRARY1.OLB; Serial No: TP33WW080; Geometry.Height: 8.65mm; PCB DECAL: TP33WW080-SPST_PADS
U9 = SWITCH_BOJKE: RST_TASTER; Source_Path: C:\CADENCE\PSD_15.1\TOOLS\ATLAS_ITA\LIBRARY1.OLB; Serial No: TP33WW080; Geometry.Height: 8.65mm; PCB DECAL: TP33WW080-SPST_PADS
U10 = LTV-817: Source_Path: C:\PROJECTS\ATLAS_XP\LIBRARY1.OLB; PCB DECAL: LTV814S

## Sheet MAX_BUS.SchDoc: ATLAS_XP2V5
size 558 x 431 mm; Organization: IMP Automatika d.o.o.; Revision: V5
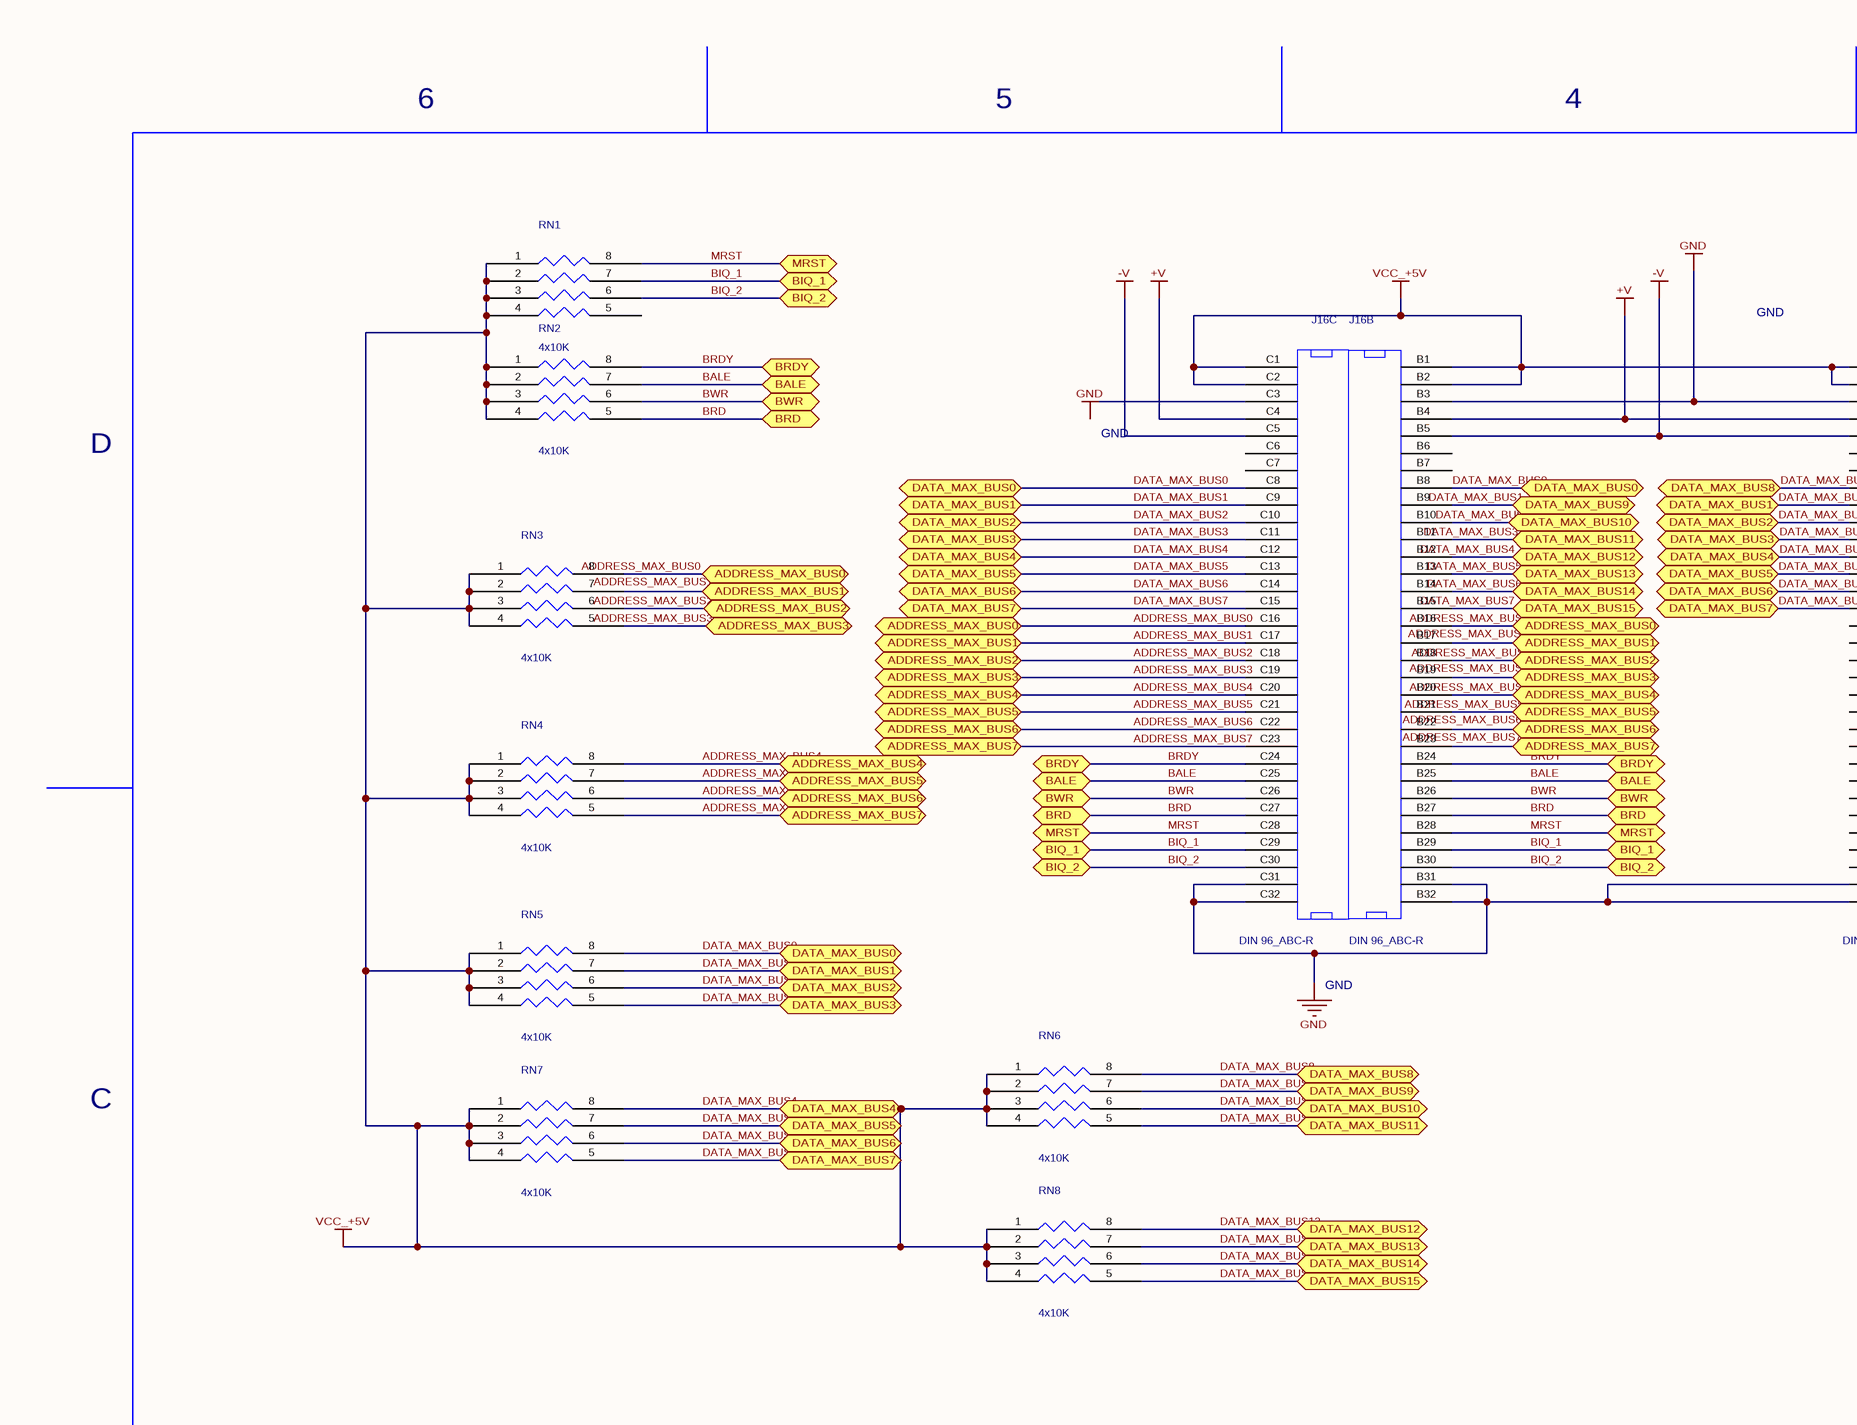
[diagram p8: MAX_BUS.SchDoc, top left]
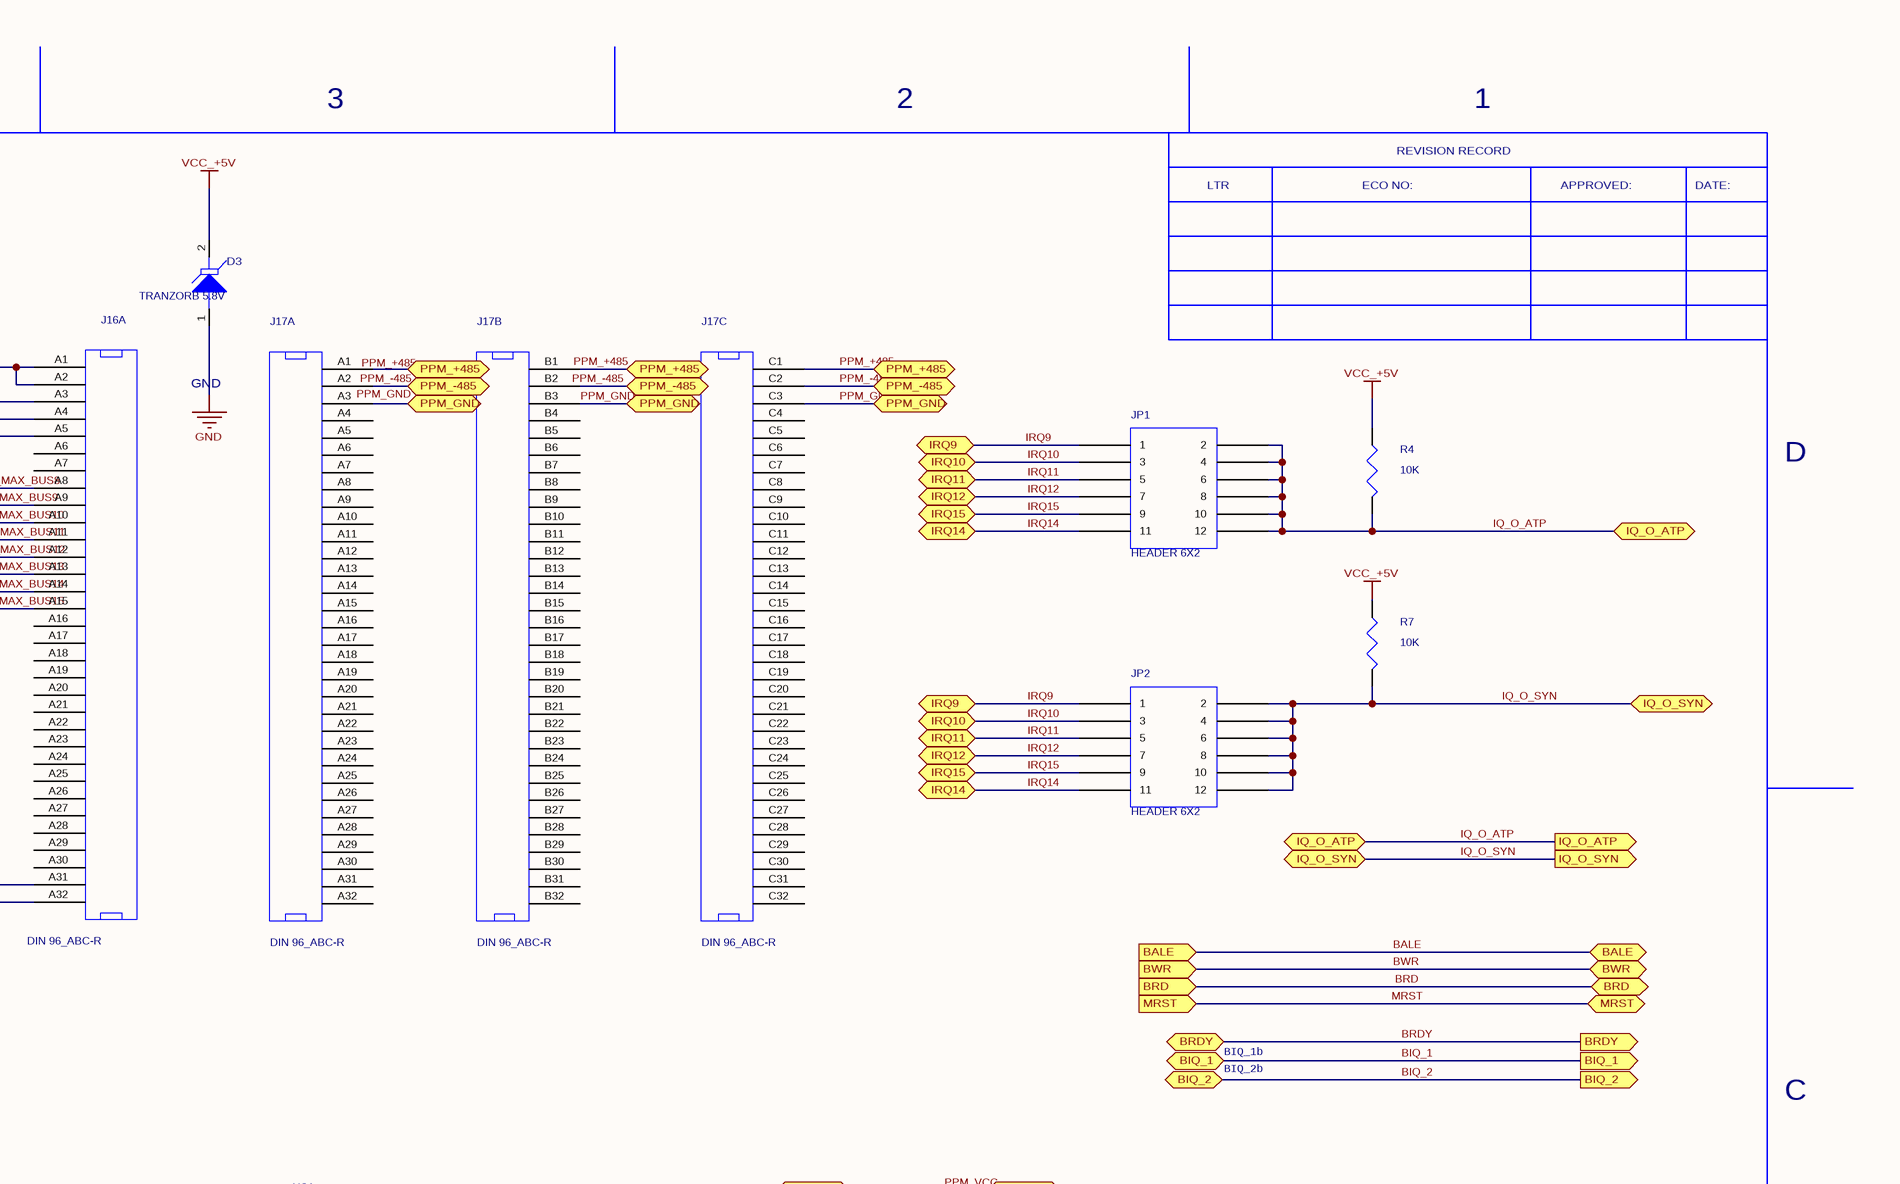
[diagram p9: MAX_BUS.SchDoc, top right]
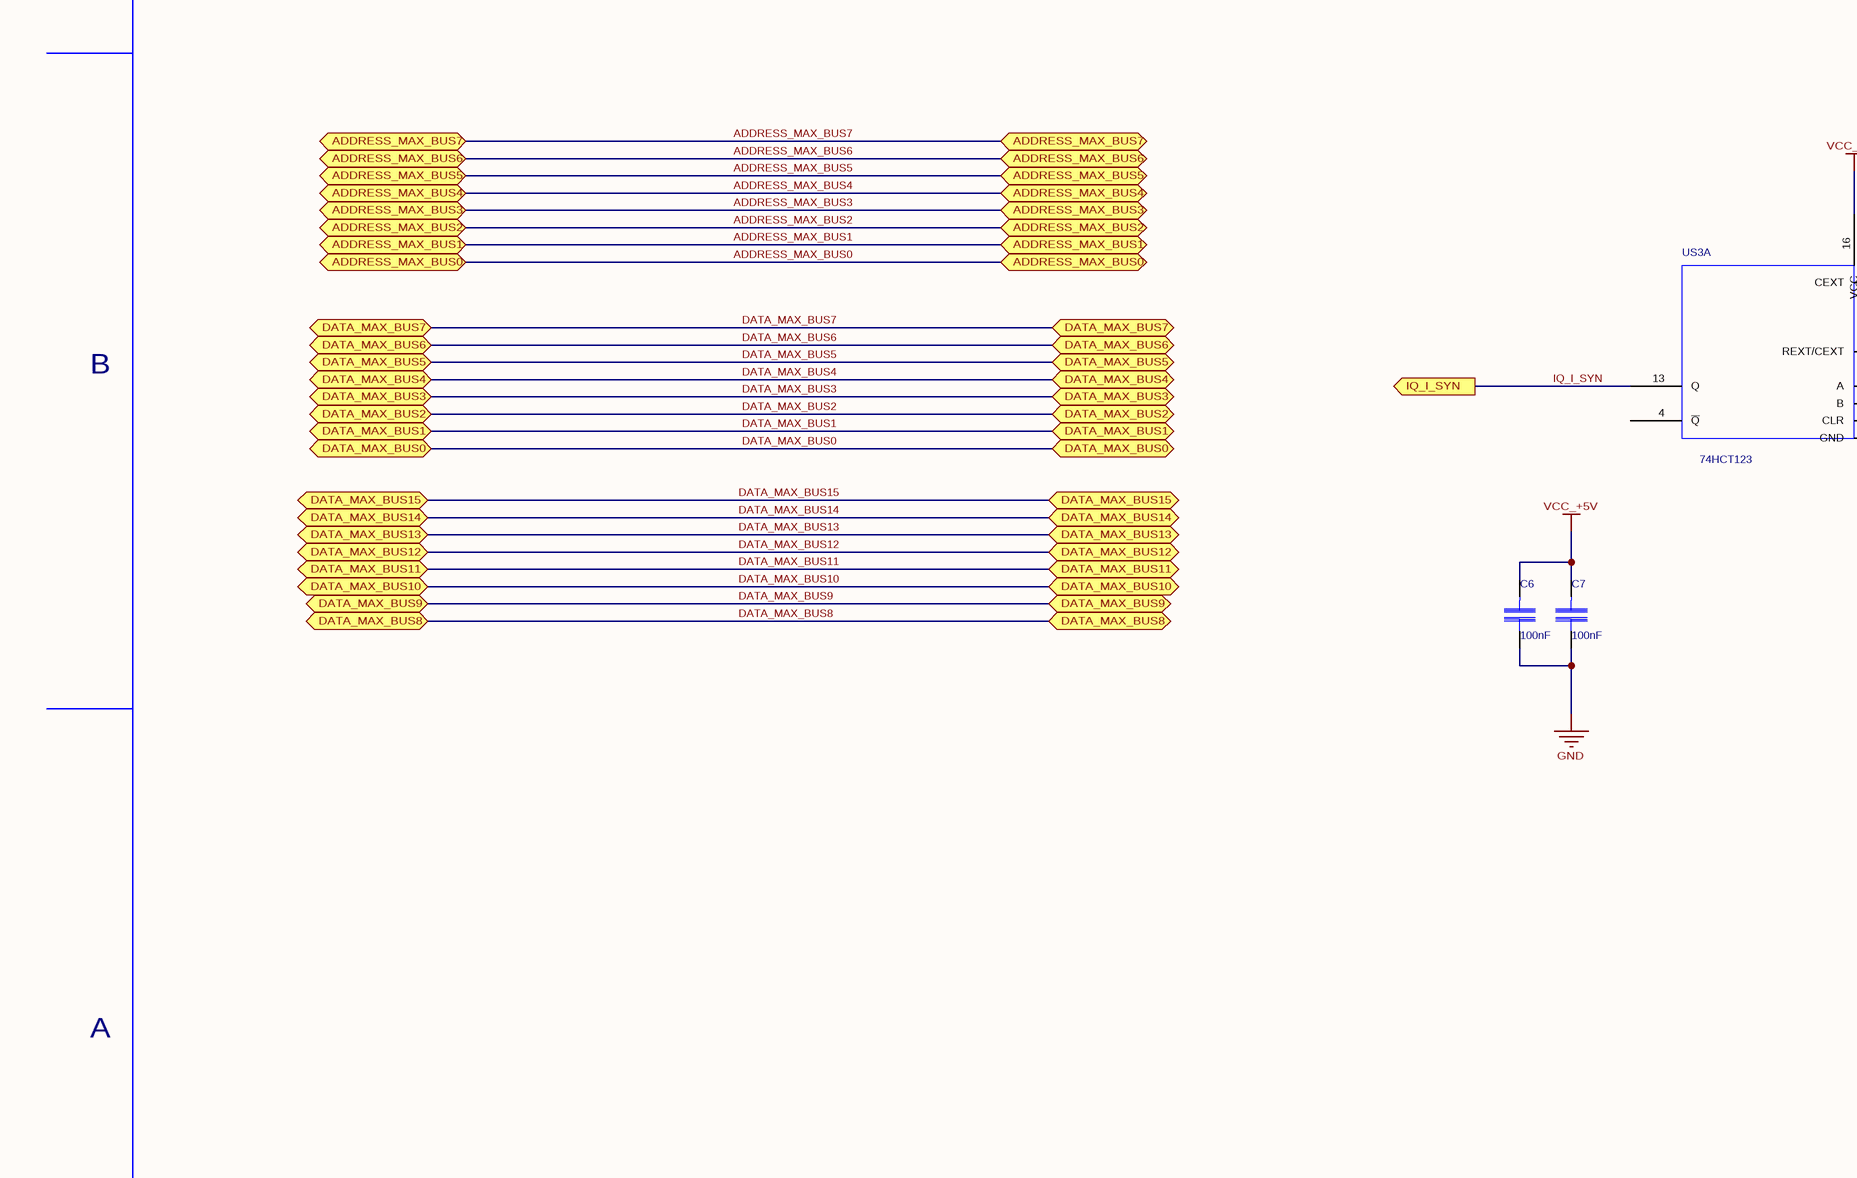
[diagram p10: MAX_BUS.SchDoc, bottom left]
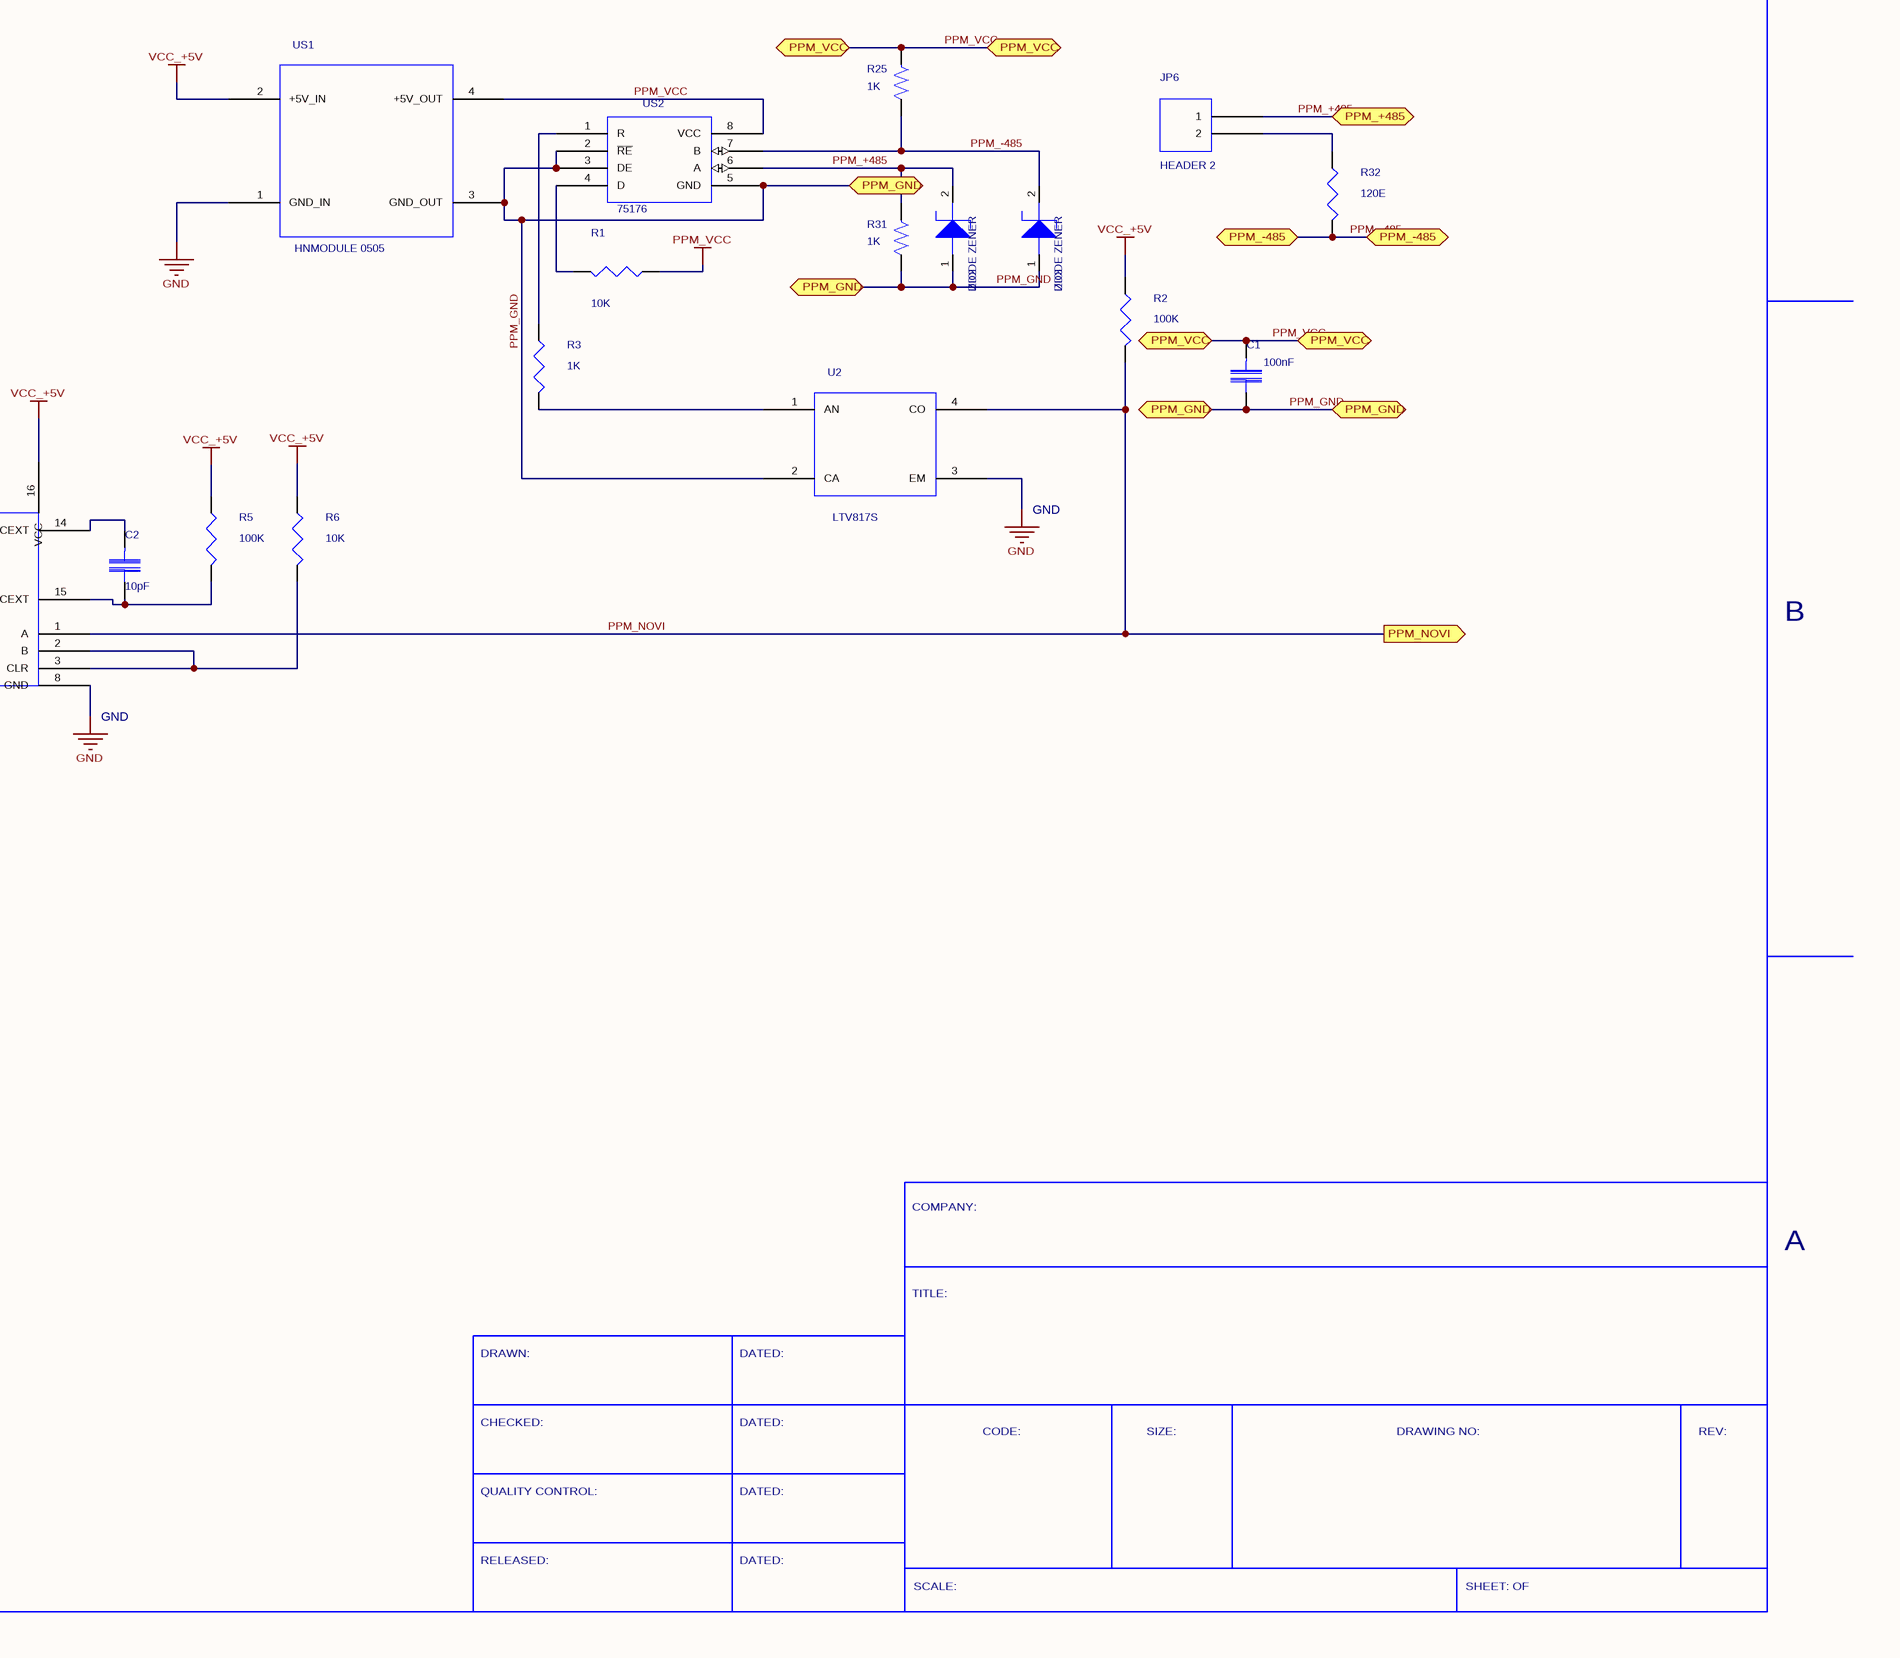
[diagram p11: MAX_BUS.SchDoc, bottom right]

### Parts
C1  value 100nF  [SM/C_0805]  (hidden comment: C)
C2  value 10pF  [SM/C_0805]  (hidden comment: C)
C6  value 100nF  [SM/C_0805]  (hidden comment: C)
C7  value 100nF  [SM/C_0805]  (hidden comment: C)
D3  value TRANZORB 5.8V  [SM/DO214AC_21]  (hidden comment: TRANZORB_0)
J16  value DIN 96_ABC-R  [DIN96_ABC/R]  (hidden comment: DIN_96_ABC-R)  (parts A,B,C of 3)
J17  value DIN 96_ABC-R  [DIN96_ABC/R]  (hidden comment: DIN_96_ABC-R)  (parts A,B,C of 3)
JP1  value HEADER 6X2  [BLKCON.100/VH/TM2OE/W.200/12]  (hidden comment: HEADER_6X2)
JP2  value HEADER 6X2  [BLKCON.100/VH/TM2OE/W.200/12]  (hidden comment: HEADER_6X2)
JP6  value HEADER 2  [JUMPER_100]  (hidden comment: HEADER_2)
R1  value 10K  [SM/R_1206]  (hidden comment: RESISTOR_2)
R2  value 100K  [SM/R_1206]  (hidden comment: RESISTOR_2)
R3  value 1K  [SM/R_1206]  (hidden comment: RESISTOR_2)
R4  value 10K  [SM/R_1206]  (hidden comment: RESISTOR_2)
R5  value 100K  [SM/R_1206]  (hidden comment: RESISTOR_2)
R6  value 10K  [SM/R_1206]  (hidden comment: RESISTOR_2)
R7  value 10K  [SM/R_1206]  (hidden comment: RESISTOR_2)
R25  value 1K  [SM/R_1206]  (hidden comment: R)
R31  value 1K  [SM/R_1206]  (hidden comment: R)
R32  value 120E  [SM/R_1206]  (hidden comment: RESISTOR_2)
RN1  value 4x10K  [SMD_RX4]  (hidden comment: RESAR_IS_4/SM)
RN2  value 4x10K  [SMD_RX4]  (hidden comment: RESAR_IS_4/SM)
RN3  value 4x10K  [SMD_RX4]  (hidden comment: RESAR_IS_4/SM)
RN4  value 4x10K  [SMD_RX4]  (hidden comment: RESAR_IS_4/SM)
RN5  value 4x10K  [SMD_RX4]  (hidden comment: RESAR_IS_4/SM)
RN6  value 4x10K  [SMD_RX4]  (hidden comment: RESAR_IS_4/SM)
RN7  value 4x10K  [SMD_RX4]  (hidden comment: RESAR_IS_4/SM)
RN8  value 4x10K  [SMD_RX4]  (hidden comment: RESAR_IS_4/SM)
U2  value LTV817S  [LTV814S]  (hidden comment: LTV-817_0)
US1  value HNMODULE 0505  [DCDC55]  (hidden comment: HNMODUL0505)
US2  75176  [SOG.050/8/WG.244/L.225]
US3  value 74HCT123  [SOG.050/16/WG.244/L.375]  (hidden comment: 74HC123_0)  (part A of 2)
ZD2  value DIODE ZENER  [SM/D_1206_21]  (hidden comment: DIODE_ZENER_0)
ZD3  value DIODE ZENER  [SM/D_1206_21]  (hidden comment: DIODE_ZENER_0)

### Ports
ADDRESS_MAX_BUS0 (bidir), ADDRESS_MAX_BUS1 (bidir), ADDRESS_MAX_BUS2 (bidir), ADDRESS_MAX_BUS3 (bidir), ADDRESS_MAX_BUS4 (bidir), ADDRESS_MAX_BUS5 (bidir), ADDRESS_MAX_BUS6 (bidir), ADDRESS_MAX_BUS7 (bidir), BALE, BALE (bidir), BIQ_1, BIQ_1 (bidir), BIQ_2, BIQ_2 (bidir), BRD, BRD (bidir), BRDY, BRDY (bidir), BWR, BWR (bidir), DATA_MAX_BUS0 (bidir), DATA_MAX_BUS1 (bidir), DATA_MAX_BUS2 (bidir), DATA_MAX_BUS3 (bidir), DATA_MAX_BUS4 (bidir), DATA_MAX_BUS5 (bidir), DATA_MAX_BUS6 (bidir), DATA_MAX_BUS7 (bidir), DATA_MAX_BUS8 (bidir), DATA_MAX_BUS9 (bidir), DATA_MAX_BUS10 (bidir), DATA_MAX_BUS11 (bidir), DATA_MAX_BUS12 (bidir), DATA_MAX_BUS13 (bidir), DATA_MAX_BUS14 (bidir), DATA_MAX_BUS15 (bidir), IQ_I_SYN (out), IQ_O_ATP, IQ_O_ATP (bidir), IQ_O_SYN, IQ_O_SYN (bidir), IRQ9 (bidir), IRQ10 (bidir), IRQ11 (bidir), IRQ12 (bidir), IRQ14 (bidir), IRQ15 (bidir), MRST, MRST (bidir), PPM_+485 (bidir), PPM_-485 (bidir), PPM_GND (bidir), PPM_NOVI, PPM_VCC (bidir)

### Nets
+V: J16.A4 J16.B4 J16.C4
-V: J16.A5 J16.B5 J16.C5
DATA_MAX_BUS12: C6.1 C7.1 D3.2(CATHODE) J16.A1 J16.A2 J16.A12 J16.B1 J16.B2 J16.B12 J16.C1 J16.C2 J16.C12 R2.1 R4.1 R5.1 R6.1 R7.1 RN1.1 RN1.2 RN1.3 RN1.4 RN2.1 RN2.2 RN2.3 RN2.4 RN3.1 RN3.2 RN3.3 RN3.4 RN4.1 RN4.2 RN4.3 RN4.4 RN5.1 RN5.2 RN5.3 RN5.4 RN6.1 RN6.2 RN6.3 RN6.4 RN7.1 RN7.2 RN7.3 RN7.4 RN7.8 RN8.1 RN8.2 RN8.3 RN8.4 RN8.8 US1.2(+5V_IN) US3.16(VCC) ; port DATA_MAX_BUS4, port DATA_MAX_BUS12  [also labelled DATA_MAX_BUS4, VCC_+5V]
GND: C6.2 C7.2 D3.1(ANODE) J16.A3 J16.A31 J16.A32 J16.B3 J16.B31 J16.B32 J16.C3 J16.C31 J16.C32 U2.3(EM) US1.1(GND_IN) US3.8(GND)
PPM_VCC: C1.1 R1.1 R25.1 US1.4(+5V_OUT) US2.8(VCC) ; port PPM_VCC
ADDRESS_MAX_BUS0: J16.B16 J16.C16 RN3.8 ; port ADDRESS_MAX_BUS0
ADDRESS_MAX_BUS1: J16.B17 J16.C17 RN3.7 ; port ADDRESS_MAX_BUS1
ADDRESS_MAX_BUS2: J16.B18 J16.C18 RN3.6 ; port ADDRESS_MAX_BUS2
ADDRESS_MAX_BUS3: J16.B19 J16.C19 RN3.5 ; port ADDRESS_MAX_BUS3
ADDRESS_MAX_BUS4: J16.B20 J16.C20 RN4.8 ; port ADDRESS_MAX_BUS4
ADDRESS_MAX_BUS5: J16.B21 J16.C21 RN4.7 ; port ADDRESS_MAX_BUS5
ADDRESS_MAX_BUS6: J16.B22 J16.C22 RN4.6 ; port ADDRESS_MAX_BUS6
ADDRESS_MAX_BUS7: J16.B23 J16.C23 RN4.5 ; port ADDRESS_MAX_BUS7
BALE: J16.B25 J16.C25 RN2.7 ; port BALE
BIQ_1: J16.B29 J16.C29 RN1.7 ; port BIQ_1
BIQ_2: J16.B30 J16.C30 RN1.6 ; port BIQ_2
BRD: J16.B27 J16.C27 RN2.5 ; port BRD
BRDY: J16.B24 J16.C24 RN2.8 ; port BRDY
BWR: J16.B26 J16.C26 RN2.6 ; port BWR
DATA_MAX_BUS0: J16.B8 J16.C8 RN5.8 ; port DATA_MAX_BUS0
DATA_MAX_BUS1: J16.A9 J16.B9 J16.C9 RN5.7 RN6.7 ; port DATA_MAX_BUS1, port DATA_MAX_BUS9  [also labelled DATA_MAX_BUS9]
DATA_MAX_BUS8: J16.A8 RN6.8 ; port DATA_MAX_BUS8
DATA_MAX_BUS10: J16.A10 J16.B10 J16.C10 RN5.6 RN6.6 ; port DATA_MAX_BUS2, port DATA_MAX_BUS10  [also labelled DATA_MAX_BUS2]
DATA_MAX_BUS11: J16.A11 J16.B11 J16.C11 RN5.5 RN6.5 ; port DATA_MAX_BUS3, port DATA_MAX_BUS11  [also labelled DATA_MAX_BUS3]
DATA_MAX_BUS13: J16.A13 J16.B13 J16.C13 RN7.7 RN8.7 ; port DATA_MAX_BUS5, port DATA_MAX_BUS13  [also labelled DATA_MAX_BUS5]
DATA_MAX_BUS14: J16.A14 J16.B14 J16.C14 RN7.6 RN8.6 ; port DATA_MAX_BUS6, port DATA_MAX_BUS14  [also labelled DATA_MAX_BUS6]
DATA_MAX_BUS15: J16.A15 J16.B15 J16.C15 RN7.5 RN8.5 ; port DATA_MAX_BUS7, port DATA_MAX_BUS15  [also labelled DATA_MAX_BUS7]
IQ_I_SYN: US3.13(Q) ; port IQ_I_SYN
IQ_O_ATP: JP1.2 JP1.4 JP1.6 JP1.8 JP1.10 JP1.12 R4.2 ; port IQ_O_ATP
IQ_O_SYN: JP2.2 JP2.4 JP2.6 JP2.8 JP2.10 JP2.12 R7.2 ; port IQ_O_SYN
IRQ9: JP1.1 JP2.1 ; port IRQ9
IRQ10: JP1.3 JP2.3 ; port IRQ10
IRQ11: JP1.5 JP2.5 ; port IRQ11
IRQ12: JP1.7 JP2.7 ; port IRQ12
IRQ14: JP1.11 JP2.11 ; port IRQ14
IRQ15: JP1.9 JP2.9 ; port IRQ15
MRST: J16.B28 J16.C28 RN1.8 ; port MRST
PPM_+485: J17.A1 J17.B1 J17.C1 JP6.1 R31.1 US2.6(A) ZD2.2(CATHODE) ; port PPM_+485
PPM_-485: J17.A2 J17.B2 J17.C2 R25.2 R32.2 US2.7(B) ZD3.2(CATHODE) ; port PPM_-485
PPM_GND: C1.2 J17.A3 J17.B3 J17.C3 R31.2 U2.2(CA) US1.3(GND_OUT) US2.2(~{RE}) US2.3(DE) US2.5(GND) ZD2.1(ANODE) ZD3.1(ANODE) ; port PPM_GND
PPM_NOVI: R2.2 U2.4(CO) US3.1(A) ; port PPM_NOVI
NetC2_1: C2.1 US3.14(CEXT)
NetC2_2: C2.2 R5.2 US3.15(REXT/CEXT)
NetJP6_2: JP6.2 R32.1
NetR1_2: R1.2 US2.4(D)
NetR3_1: R3.1 US2.1(R)
NetR3_2: R3.2 U2.1(AN)
NetR6_2: R6.2 US3.2(B) US3.3(CLR)

Not connected (* = marked no-connect by the designer): J16 A6 A7 A16 A17 A18 A19 A20 A21 A22 A23 A24 A25 A26 A27 A28 A29 A30 B6 B7 C6 C7; J17 A4 A5 A6 A7 A8 A9 A10 A11 A12 A13 A14 A15 A16 A17 A18 A19 A20 A21 A22 A23 A24 A25 A26 A27 A28 A29 A30 A31 A32 B4 B5 B6 B7 B8 B9 B10 B11 B12 B13 B14 B15 B16 B17 B18 B19 B20 B21 B22 B23 B24 B25 B26 B27 B28 B29 B30 B31 B32 C4 C5 C6 C7 C8 C9 C10 C11 C12 C13 C14 C15 C16 C17 C18 C19 C20 C21 C22 C23 C24 C25 C26 C27 C28 C29 C30 C31 C32; RN1 5; US3 4(~{Q})

### Notes on the sheet
- 6
- 5
- 4
- 3
- 2
- 1
- LTR
- ECO NO:
- REVISION RECORD
- APPROVED:
- DATE:
- GND
- D
- BIQ_1b
- C
- BIQ_2b
- B
- (near US3) GND
- COMPANY:
- A
- TITLE:
- DRAWN:
- DATED:
- CHECKED:
- CODE:
- SIZE:
- DRAWING NO:
- REV:
- QUALITY CONTROL:
- RELEASED:
- SCALE:
- SHEET: OF
- Labels drawn without touching a wire or pin: ADDRESS_MAX_BUS0, ADDRESS_MAX_BUS1, ADDRESS_MAX_BUS2, ADDRESS_MAX_BUS3, ADDRESS_MAX_BUS4, ADDRESS_MAX_BUS5, ADDRESS_MAX_BUS6, ADDRESS_MAX_BUS7, DATA_MAX_BUS1, DATA_MAX_BUS2, DATA_MAX_BUS3, DATA_MAX_BUS4, DATA_MAX_BUS5, DATA_MAX_BUS6, DATA_MAX_BUS7, PPM_+485, PPM_-485, PPM_GND

### Library data of the parts
C1 C2 C6 C7 = C: Source_Path: D:\ORCADWIN\CAPTURE\ATP_LATT_01\ATP_00.OLB; SDTSourceLibName: C:\WINDOWS\TEMP\ATP_00.LIB; PCB DECAL: SM/C_0805
D3 = TRANZORB_0: as D2 on sheet POWER_SUPPLY; PCB DECAL: SM/DO214AC_21
J16 J17 = DIN_96_ABC-R: Source_Path: C:\ORCAD\ORCAD_10.5\TOOLS\CAPTURE\LIBRARY\CONNECTOR.OLB; PCB DECAL: DIN96_ABC/R
JP1 JP2 = HEADER_6X2: Source_Path: D:\ORCADWIN\CAPTURE\PTA\PC2A_00.OLB; SDTSourceLibName: C:\WINDOWS\TEMP\PC2A_00.LIB; PCB DECAL: BLKCON.100/VH/TM2OE/W.200/12
JP6 = HEADER_2: as JP4 on sheet WDT_TASTERI_M_S; PCB DECAL: JUMPER_100
R1-R7 R32 = RESISTOR_2: as R12 on sheet WDT_TASTERI_M_S; PCB DECAL: SM/R_1206
R25 R31 = R: as R27 on sheet POWER_SUPPLY; PCB DECAL: SM/R_1206
RN1-RN8 = RESAR_IS_4/SM: as RN9 on sheet WDT_TASTERI_M_S; PCB DECAL: SMD_RX4
U2 = LTV-817_0: Source_Path: E:\MILOS\PROJECTS\ATLAS_XP\ATLAS_XP.DSN; PCB DECAL: LTV814S
US1 = HNMODUL0505: Source_Path: C:\PROJECTS\ATLAS_ITA\LIBRARY1.OLB; PCB DECAL: DCDC55
US2 = 75176: Source_Path: C:\ORCADESP\SDT\LIBRARY\TARIFA_O.OLB; PCB DECAL: SOG.050/8/WG.244/L.225; Value: 75176
US3 = 74HC123_0: Source_Path: E:\MILOS\PROJECTS\ATLAS_XP\ATLAS_XP.DSN; PCB DECAL: SOG.050/16/WG.244/L.375
ZD2 ZD3 = DIODE_ZENER_0: Source_Path: C:\PROJECTS\VHDL_PROJEKTI\BIS32W_ORCAD\BIS32W\BIS32_16.DSN; PCB DECAL: SM/D_1206_21

## Sheet PROBA.SchDoc: ATLAS_XP2V5
size 558 x 431 mm; Organization: IMP Automatika d.o.o.; Revision: V5
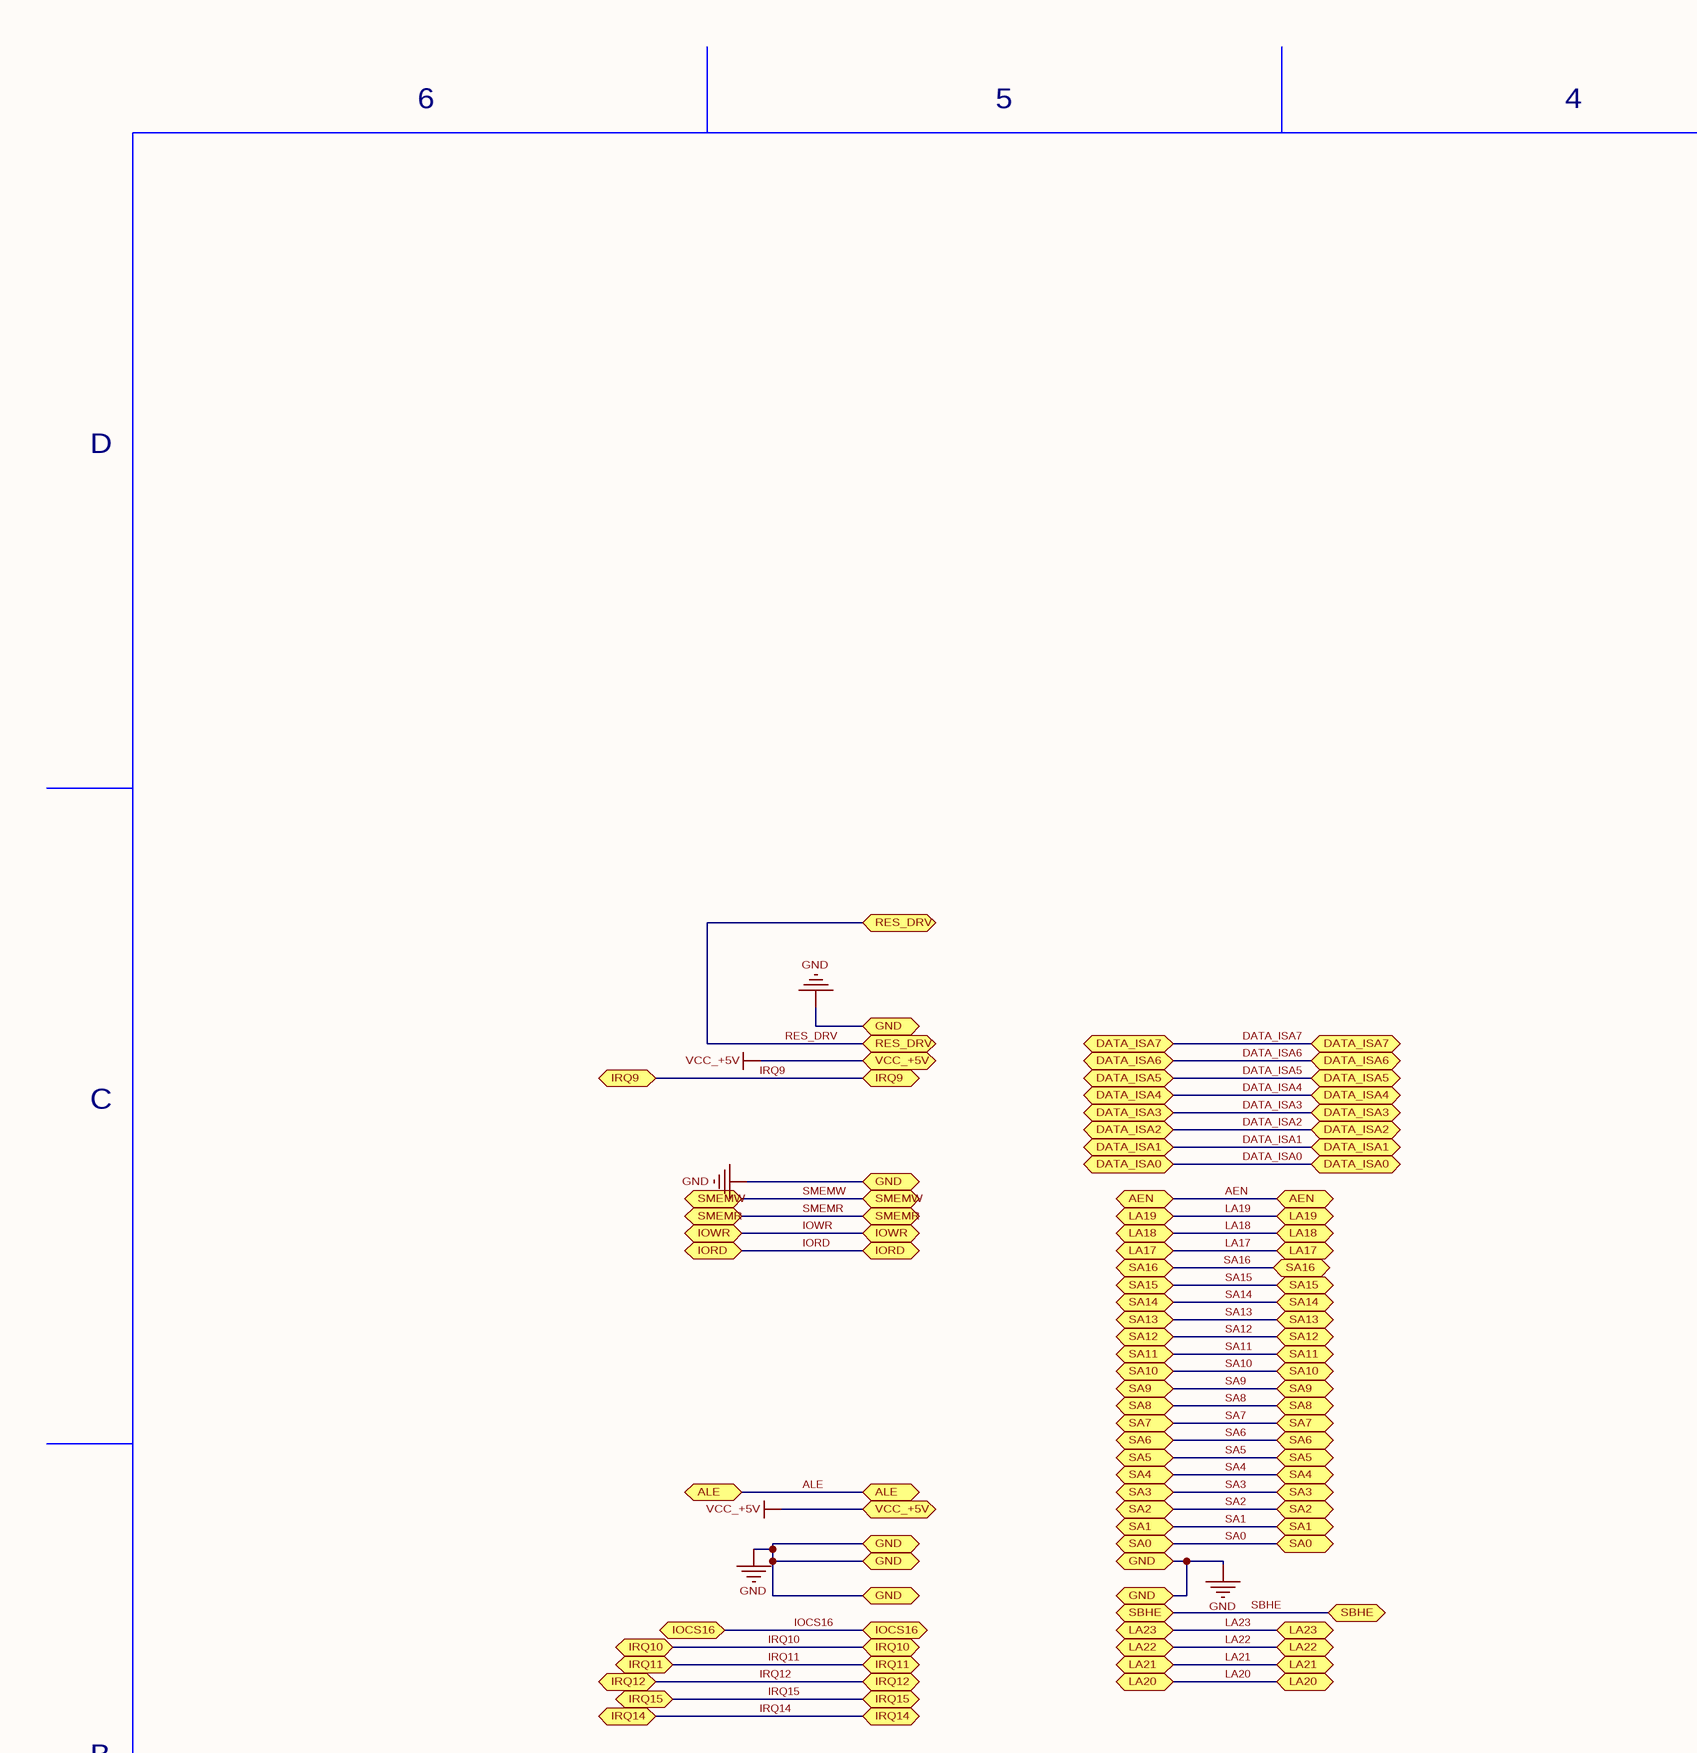
[diagram p12: PROBA.SchDoc, top left]
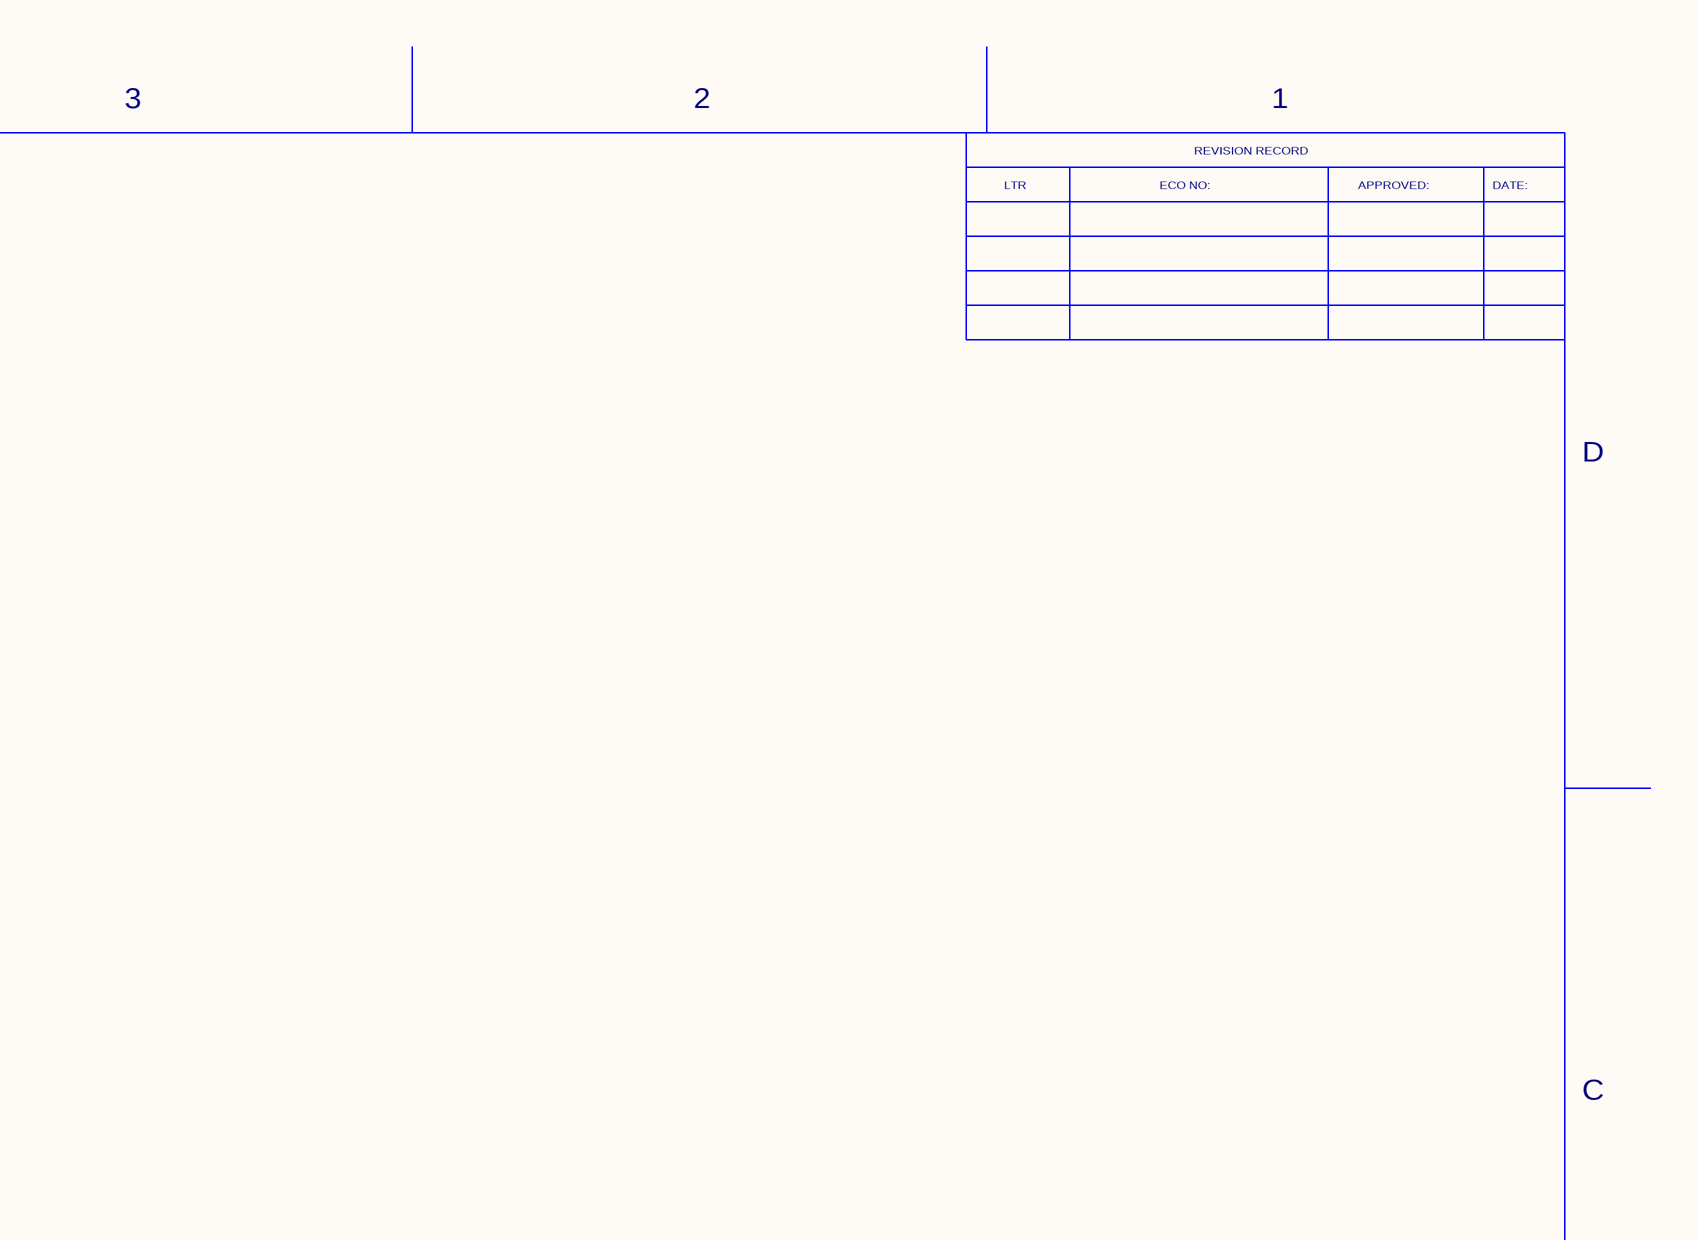
[diagram p13: PROBA.SchDoc, top right]
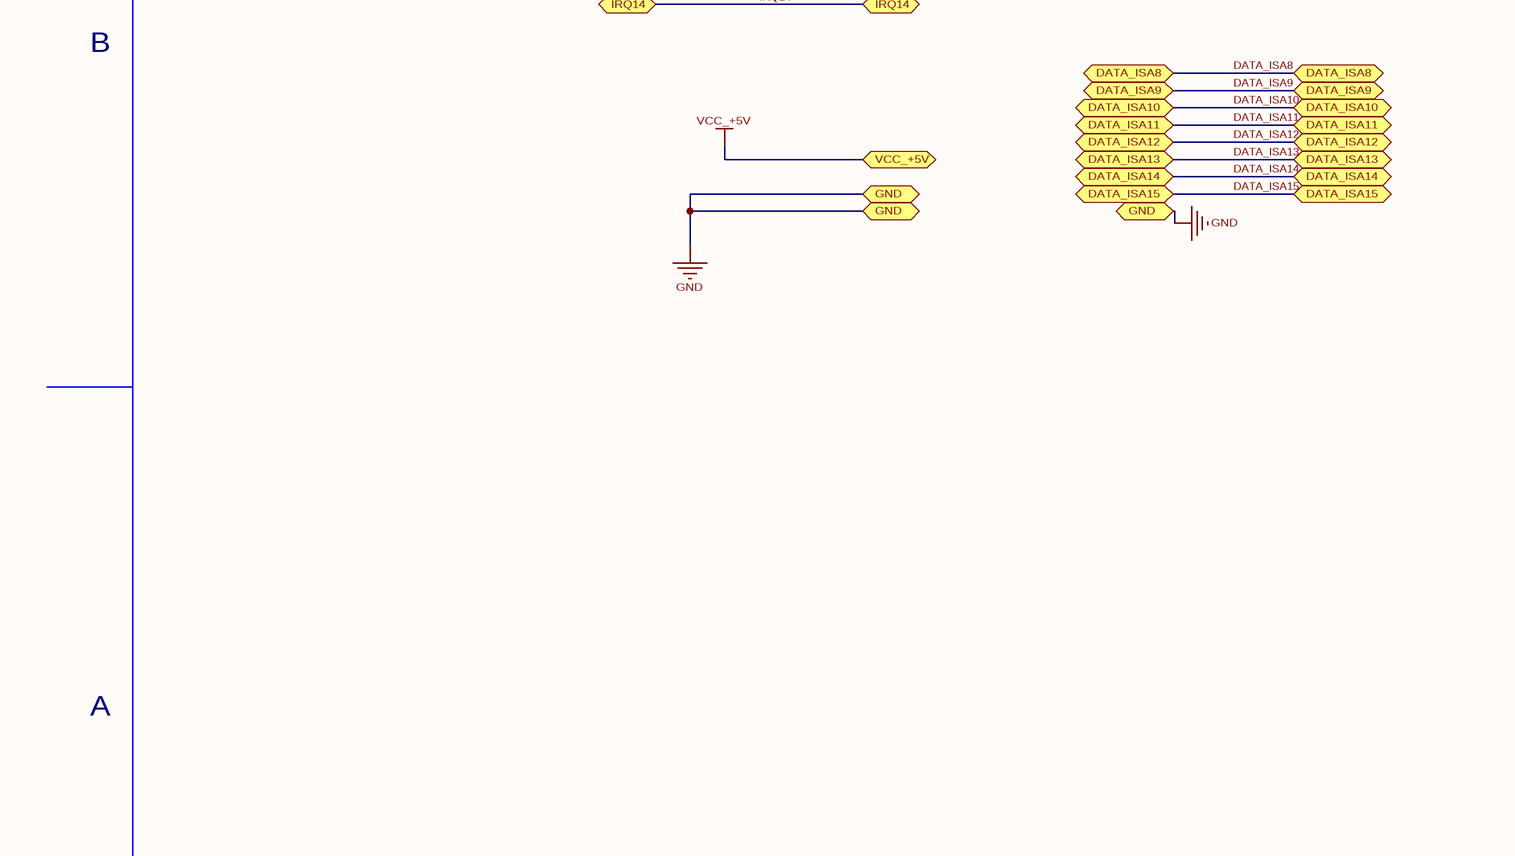
[diagram p14: PROBA.SchDoc, bottom left]
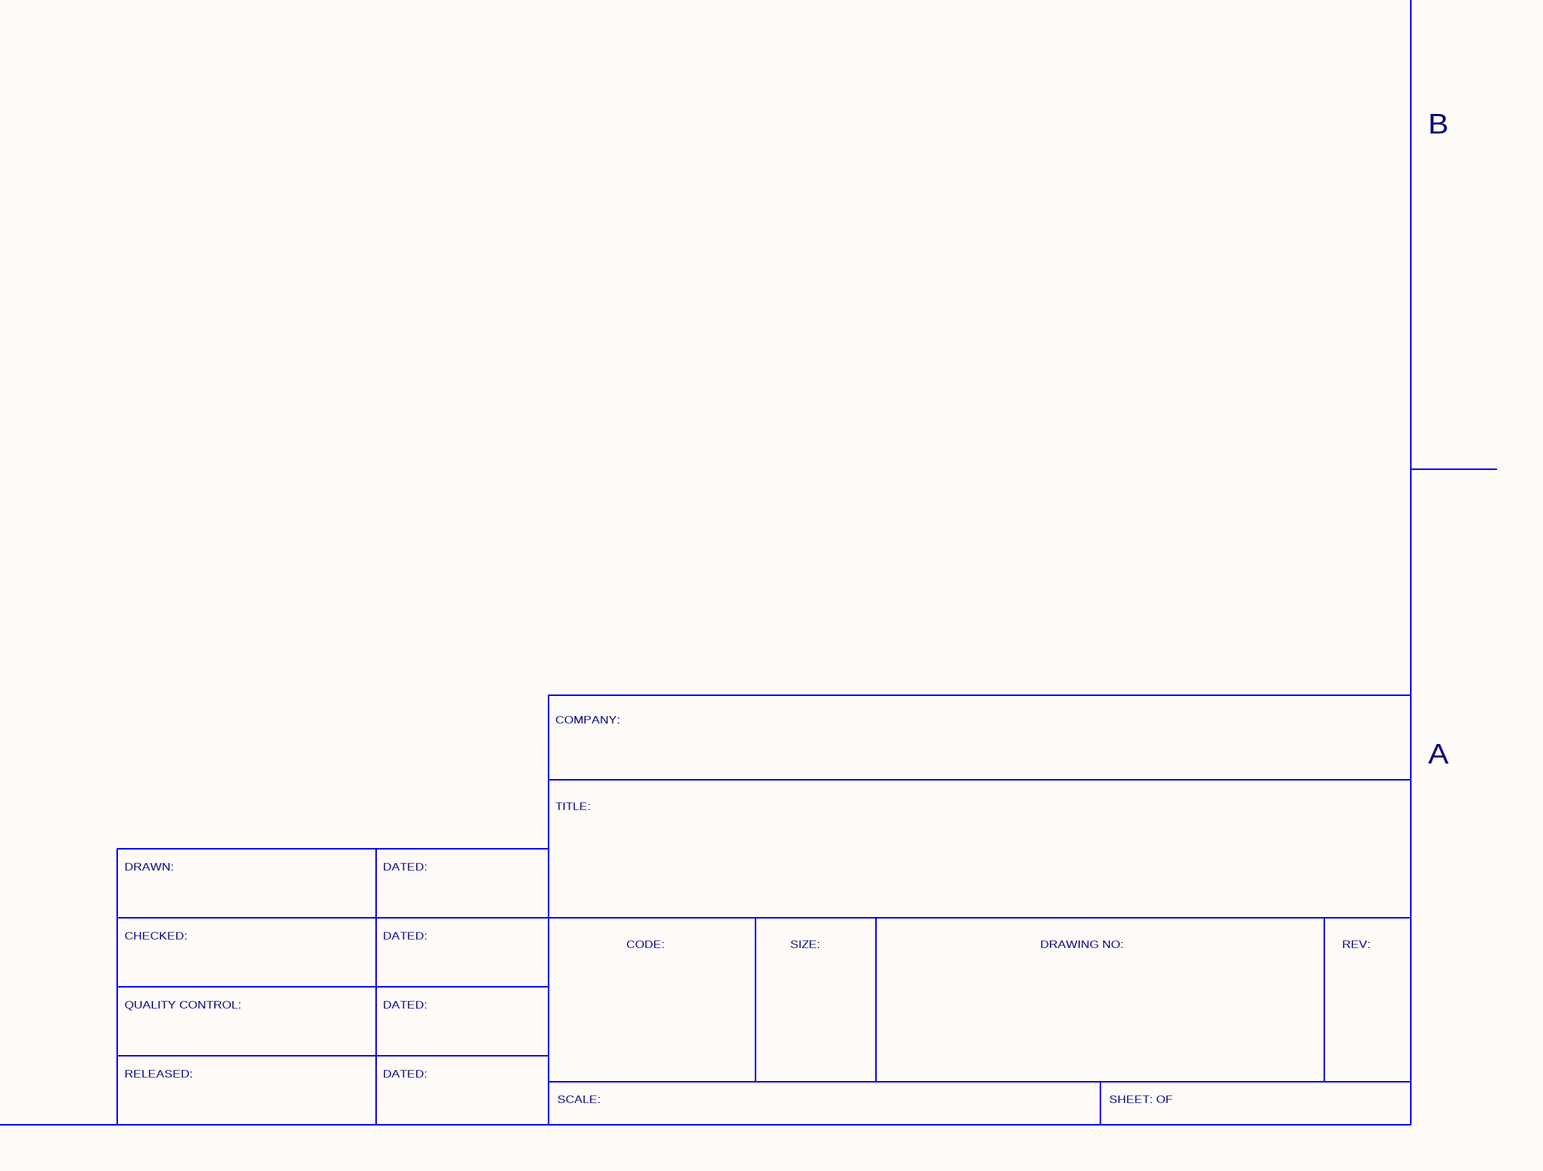
[diagram p15: PROBA.SchDoc, bottom right]

### Ports
AEN (bidir), ALE (bidir), DATA_ISA0 (bidir), DATA_ISA1 (bidir), DATA_ISA2 (bidir), DATA_ISA3 (bidir), DATA_ISA4 (bidir), DATA_ISA5 (bidir), DATA_ISA6 (bidir), DATA_ISA7 (bidir), DATA_ISA8 (bidir), DATA_ISA9 (bidir), DATA_ISA10 (bidir), DATA_ISA11 (bidir), DATA_ISA12 (bidir), DATA_ISA13 (bidir), DATA_ISA14 (bidir), DATA_ISA15 (bidir), GND (bidir), IOCS16 (bidir), IORD (bidir), IOWR (bidir), IRQ9 (bidir), IRQ10 (bidir), IRQ11 (bidir), IRQ12 (bidir), IRQ14 (bidir), IRQ15 (bidir), LA17 (bidir), LA18 (bidir), LA19 (bidir), LA20 (bidir), LA21 (bidir), LA22 (bidir), LA23 (bidir), RES_DRV (bidir), SA0 (bidir), SA1 (bidir), SA2 (bidir), SA3 (bidir), SA4 (bidir), SA5 (bidir), SA6 (bidir), SA7 (bidir), SA8 (bidir), SA9 (bidir), SA10 (bidir), SA11 (bidir), SA12 (bidir), SA13 (bidir), SA14 (bidir), SA15 (bidir), SA16 (bidir), SBHE (bidir), SMEMR (bidir), SMEMW (bidir), VCC_+5V (bidir)

### Notes on the sheet
- 6
- 5
- 4
- 3
- 2
- 1
- LTR
- ECO NO:
- REVISION RECORD
- APPROVED:
- DATE:
- D
- C
- B
- COMPANY:
- A
- TITLE:
- DRAWN:
- DATED:
- CHECKED:
- CODE:
- SIZE:
- DRAWING NO:
- REV:
- QUALITY CONTROL:
- RELEASED:
- SCALE:
- SHEET: OF

## Sheet ATLAS_XP2V5.Sheet 5.SchDoc: ATLAS_XP2V5
size 558 x 431 mm; Organization: IMP Automatika d.o.o.; Revision: V5
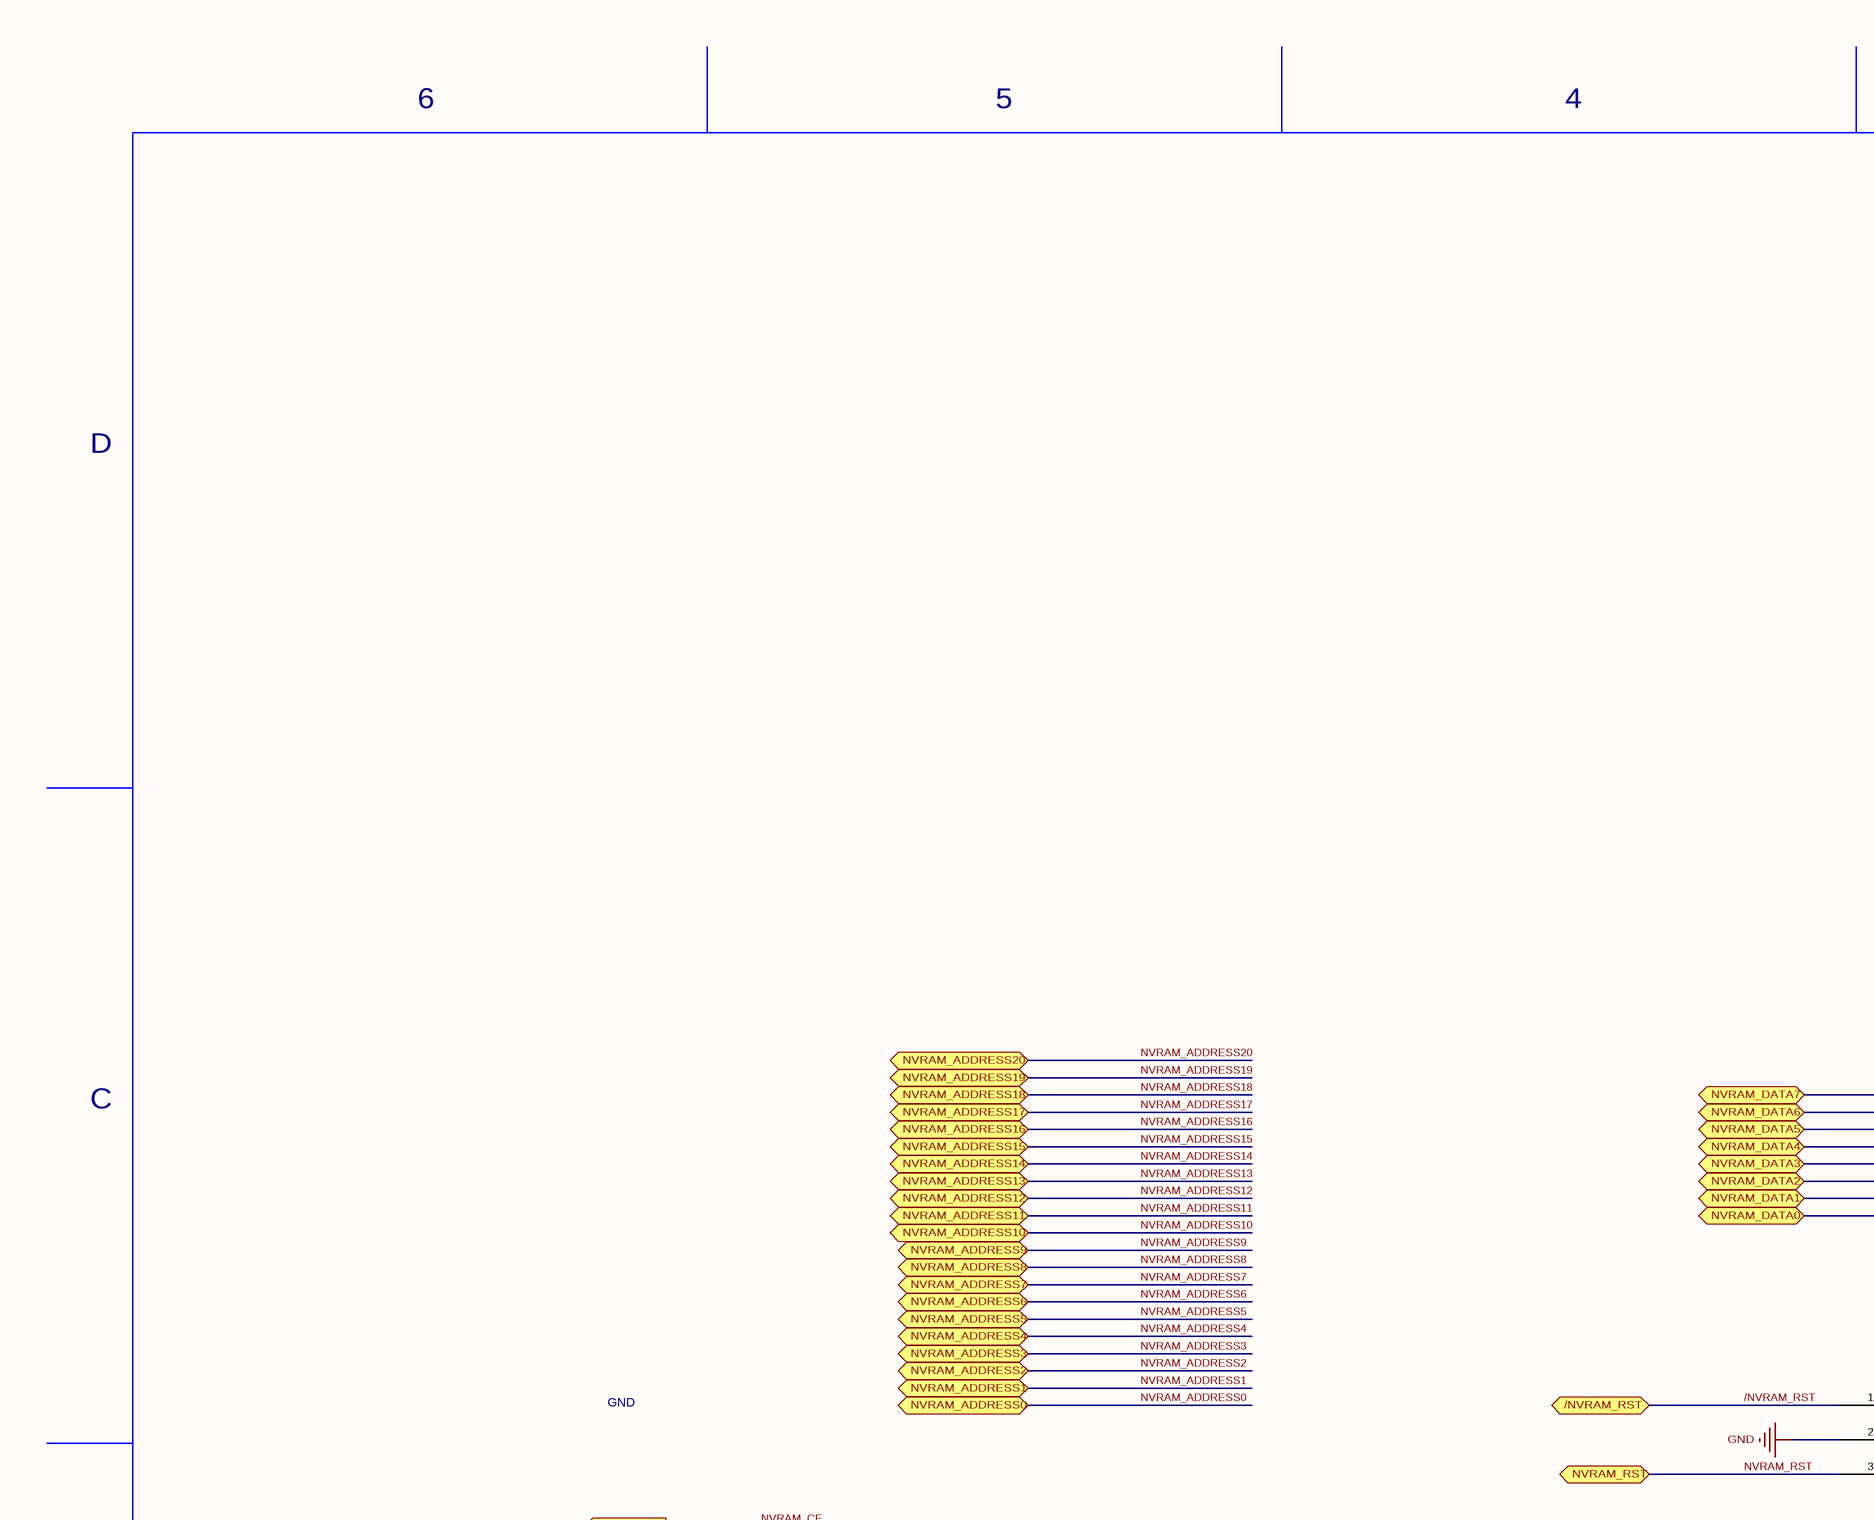
[diagram p16: ATLAS_XP2V5.Sheet 5.SchDoc, top left]
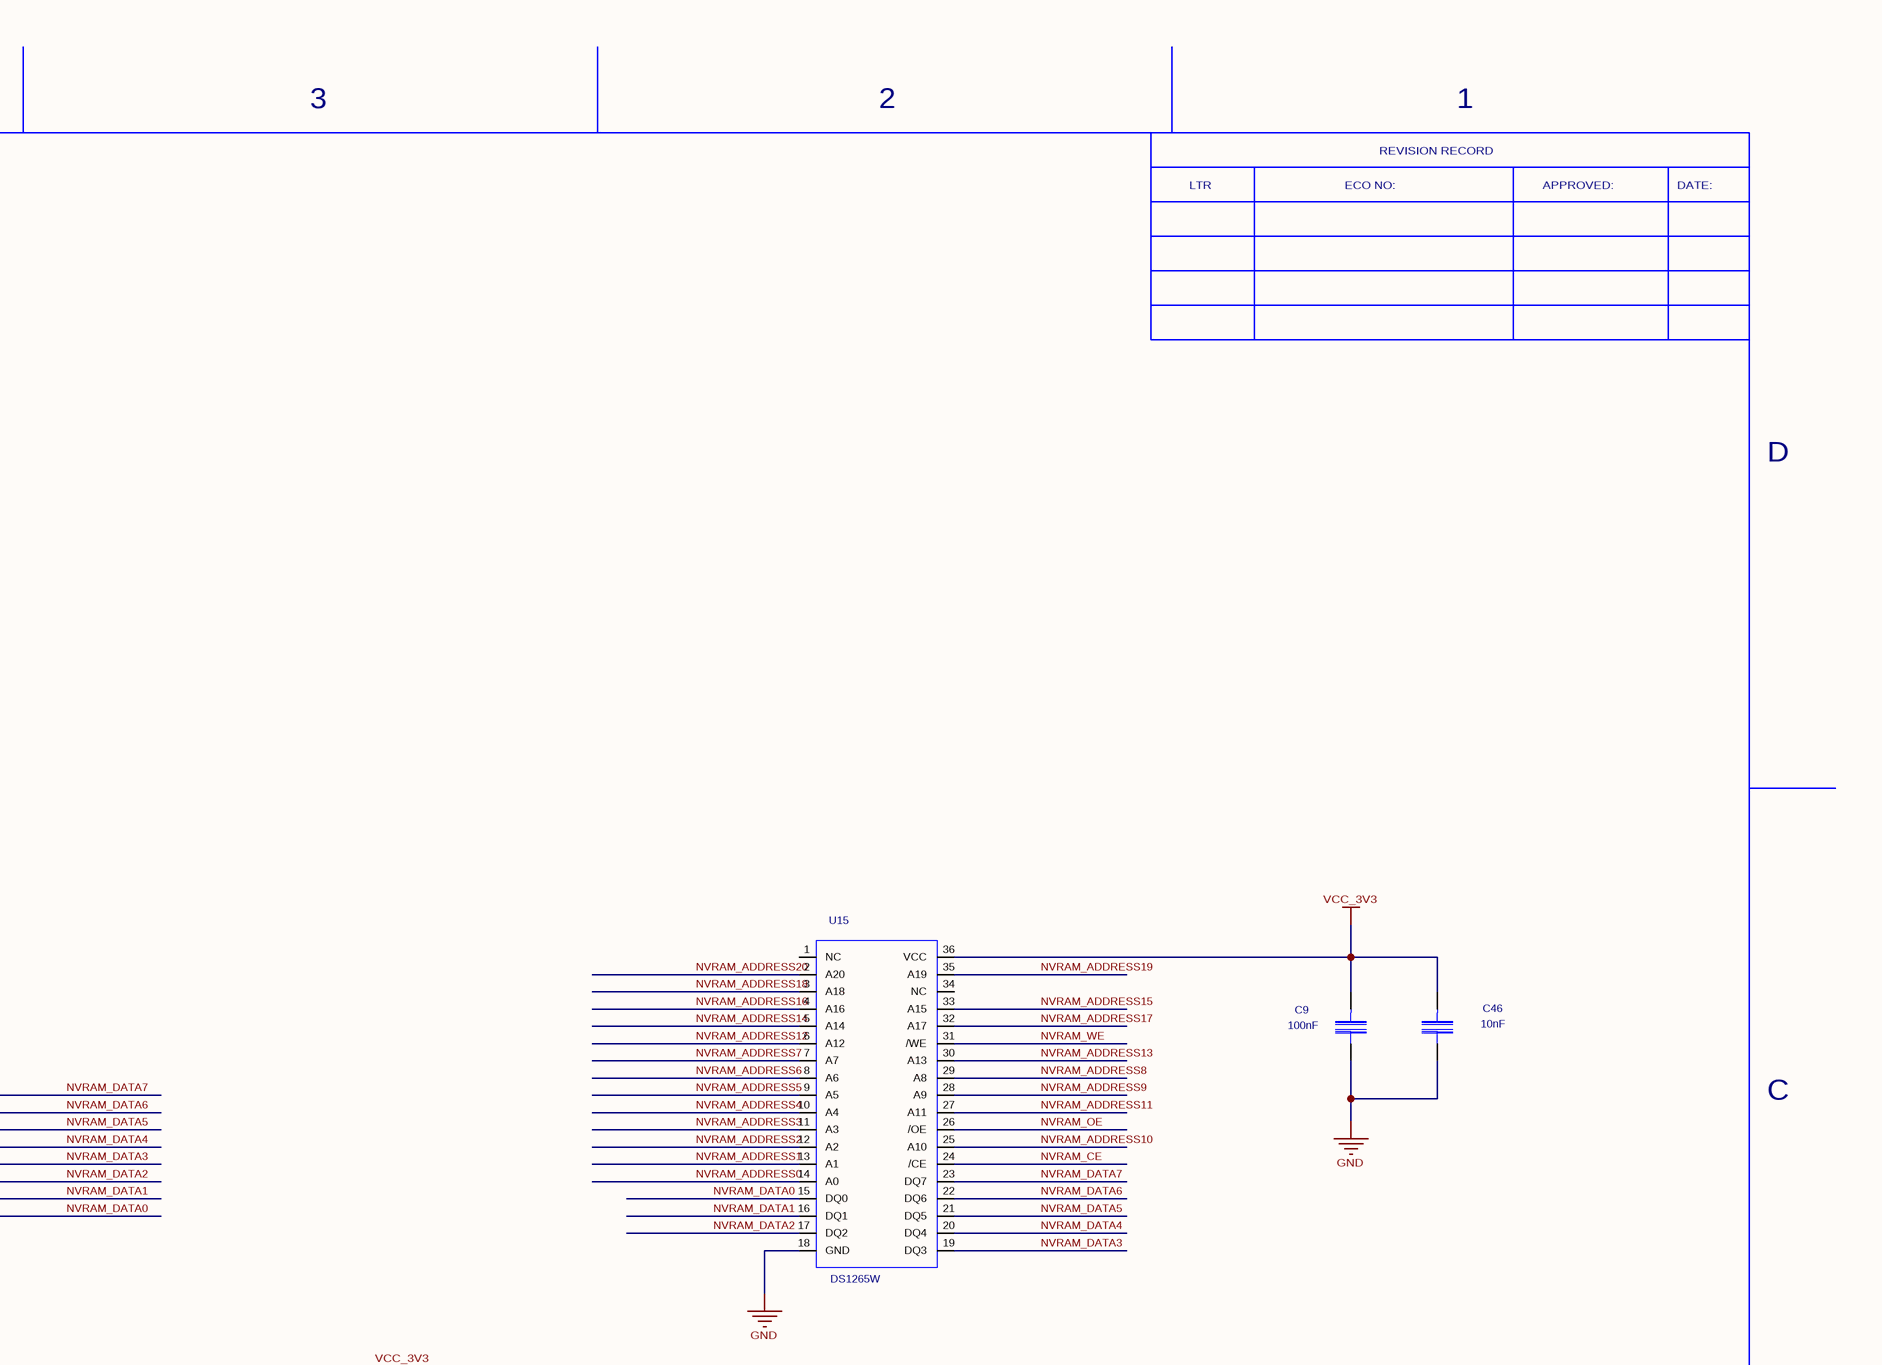
[diagram p17: ATLAS_XP2V5.Sheet 5.SchDoc, top right]
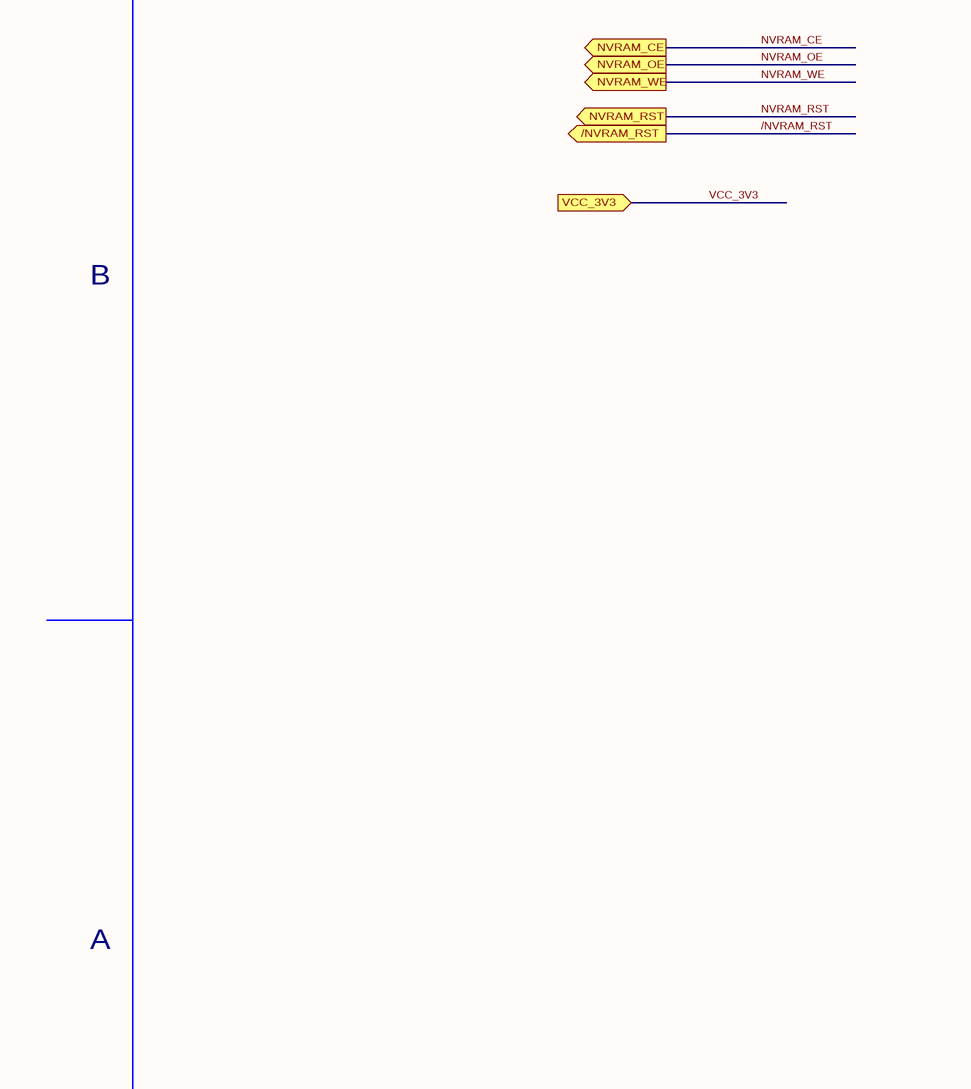
[diagram p18: ATLAS_XP2V5.Sheet 5.SchDoc, bottom left]
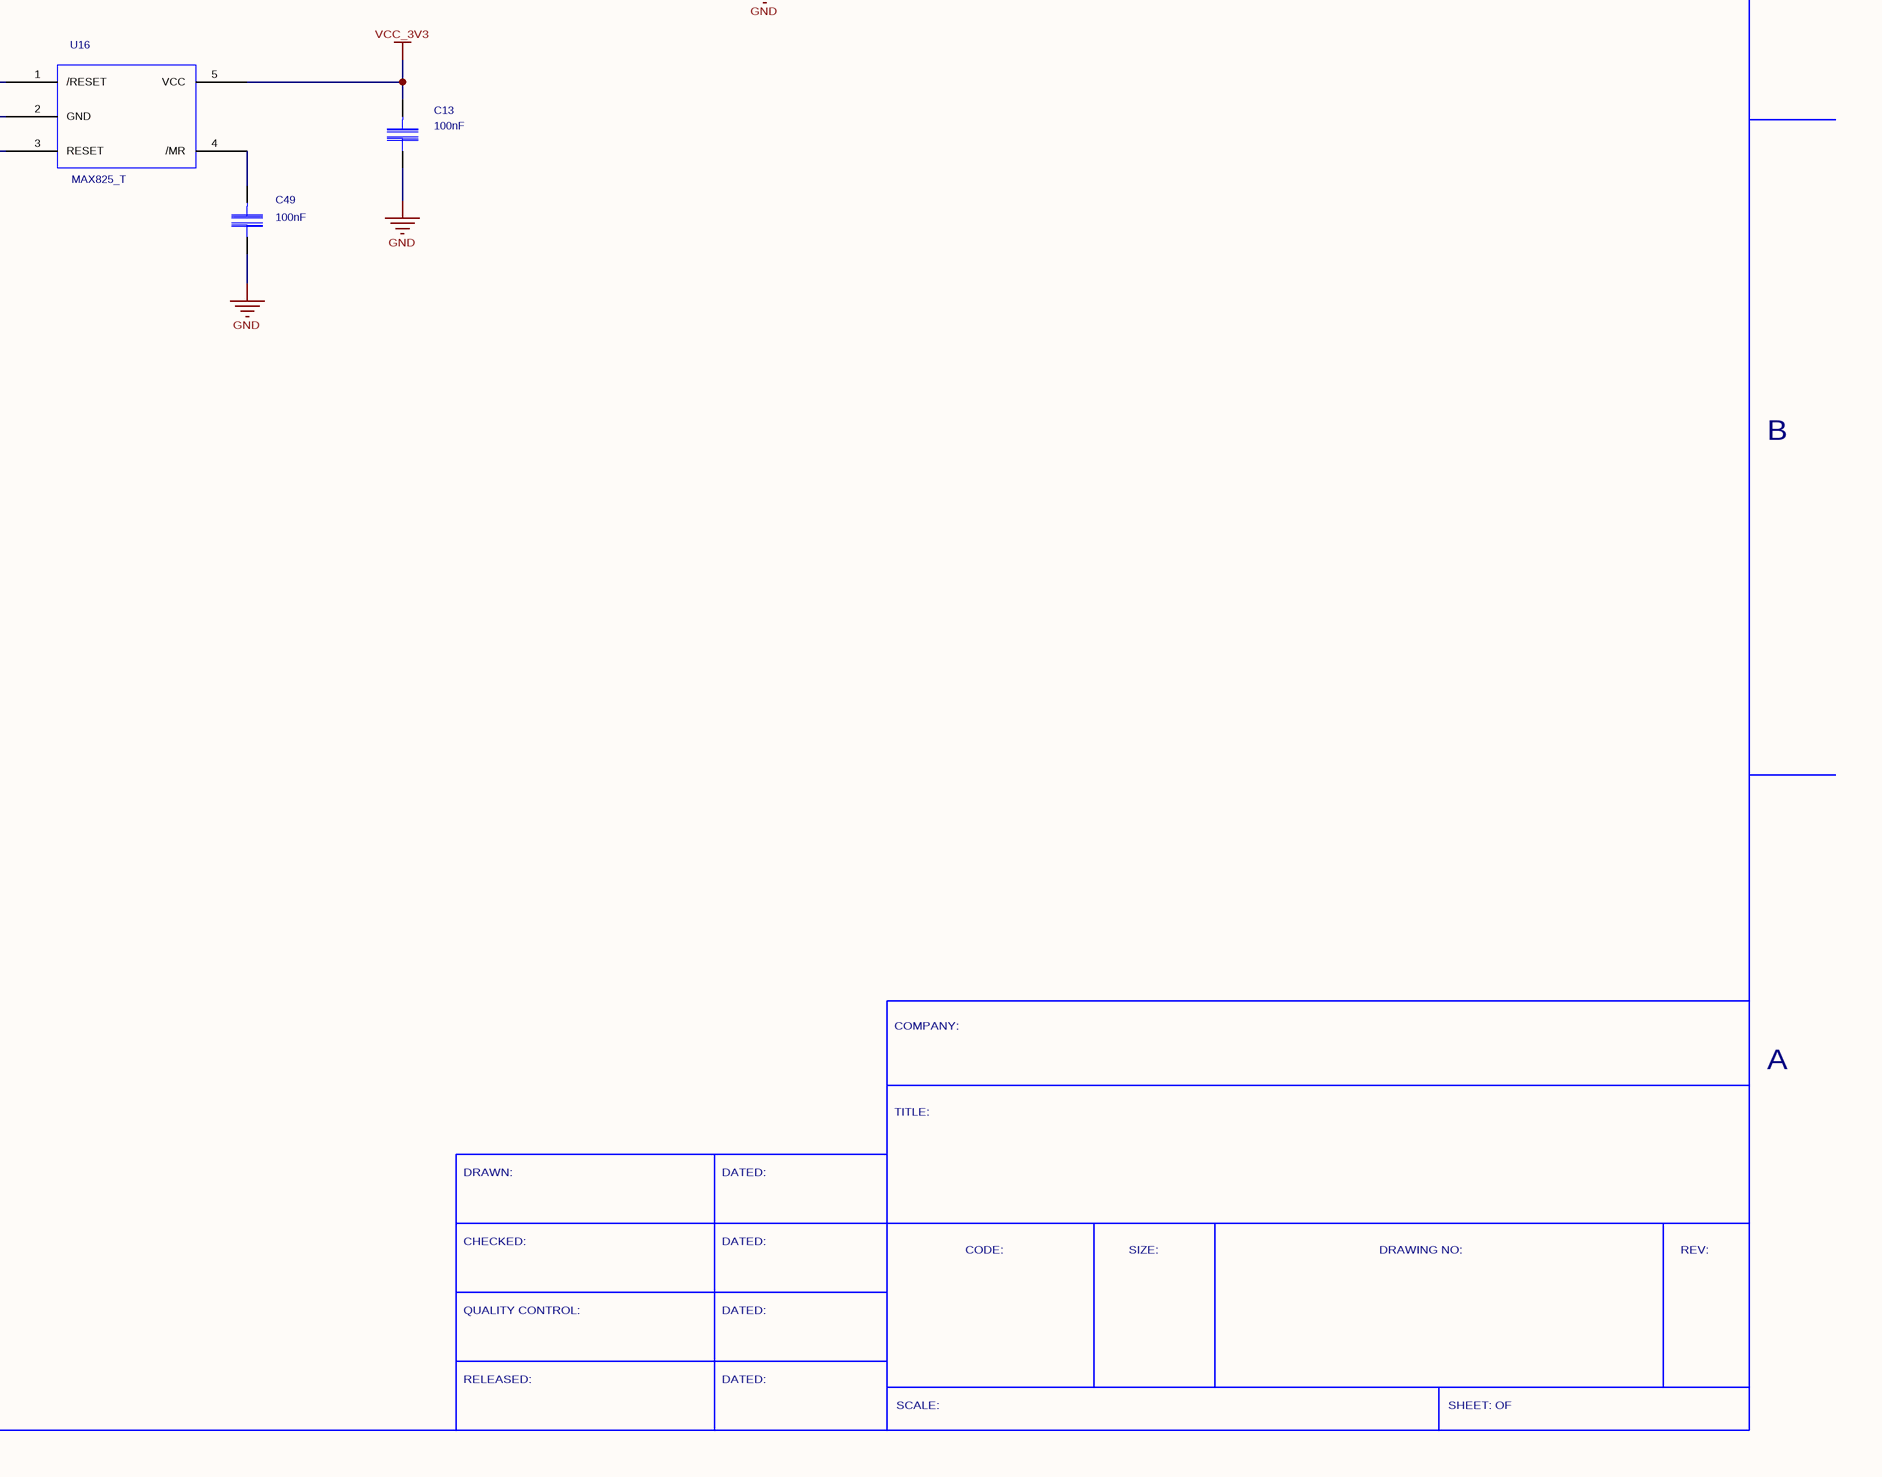
[diagram p19: ATLAS_XP2V5.Sheet 5.SchDoc, bottom right]

### Parts
C9  value 100nF  [SM/C_0805]  (hidden comment: C)
C13  value 100nF  [SM/C_0805]  (hidden comment: C)
C46  value 10nF  [SM/C_0805]  (hidden comment: C)
C49  value 100nF  [SM/C_0805]  (hidden comment: C)
U15  DS1265W  [DIP.100/36/W.600/L1.850]
U16  MAX825_T  [SOT23_5_MILOS_REV4]

### Ports
/NVRAM_RST (bidir), /NVRAM_RST (out), NVRAM_ADDRESS0 (bidir), NVRAM_ADDRESS1 (bidir), NVRAM_ADDRESS2 (bidir), NVRAM_ADDRESS3 (bidir), NVRAM_ADDRESS4 (bidir), NVRAM_ADDRESS5 (bidir), NVRAM_ADDRESS6 (bidir), NVRAM_ADDRESS7 (bidir), NVRAM_ADDRESS8 (bidir), NVRAM_ADDRESS9 (bidir), NVRAM_ADDRESS10 (bidir), NVRAM_ADDRESS11 (bidir), NVRAM_ADDRESS12 (bidir), NVRAM_ADDRESS13 (bidir), NVRAM_ADDRESS14 (bidir), NVRAM_ADDRESS15 (bidir), NVRAM_ADDRESS16 (bidir), NVRAM_ADDRESS17 (bidir), NVRAM_ADDRESS18 (bidir), NVRAM_ADDRESS19 (bidir), NVRAM_ADDRESS20 (bidir), NVRAM_CE (out), NVRAM_DATA0 (bidir), NVRAM_DATA1 (bidir), NVRAM_DATA2 (bidir), NVRAM_DATA3 (bidir), NVRAM_DATA4 (bidir), NVRAM_DATA5 (bidir), NVRAM_DATA6 (bidir), NVRAM_DATA7 (bidir), NVRAM_OE (out), NVRAM_RST (bidir), NVRAM_RST (out), NVRAM_WE (out), VCC_3V3

### Nets
GND: C9.2 C13.2 C46.2 C49.2 U15.18(GND) U16.2(GND)
VCC_3V3: C9.1 C13.1 C46.1 U15.36(VCC) U16.5(VCC) ; port VCC_3V3
/NVRAM_RST: U16.1(/RESET) ; port /NVRAM_RST
NVRAM_ADDRESS0: U15.14(A0) ; port NVRAM_ADDRESS0
NVRAM_ADDRESS1: U15.13(A1) ; port NVRAM_ADDRESS1
NVRAM_ADDRESS2: U15.12(A2) ; port NVRAM_ADDRESS2
NVRAM_ADDRESS3: U15.11(A3) ; port NVRAM_ADDRESS3
NVRAM_ADDRESS4: U15.10(A4) ; port NVRAM_ADDRESS4
NVRAM_ADDRESS5: U15.9(A5) ; port NVRAM_ADDRESS5
NVRAM_ADDRESS6: U15.8(A6) ; port NVRAM_ADDRESS6
NVRAM_ADDRESS7: U15.7(A7) ; port NVRAM_ADDRESS7
NVRAM_ADDRESS8: U15.29(A8) ; port NVRAM_ADDRESS8
NVRAM_ADDRESS9: U15.28(A9) ; port NVRAM_ADDRESS9
NVRAM_ADDRESS10: U15.25(A10) ; port NVRAM_ADDRESS10
NVRAM_ADDRESS11: U15.27(A11) ; port NVRAM_ADDRESS11
NVRAM_ADDRESS12: U15.6(A12) ; port NVRAM_ADDRESS12
NVRAM_ADDRESS13: U15.30(A13) ; port NVRAM_ADDRESS13
NVRAM_ADDRESS14: U15.5(A14) ; port NVRAM_ADDRESS14
NVRAM_ADDRESS15: U15.33(A15) ; port NVRAM_ADDRESS15
NVRAM_ADDRESS16: U15.4(A16) ; port NVRAM_ADDRESS16
NVRAM_ADDRESS17: U15.32(A17) ; port NVRAM_ADDRESS17
NVRAM_ADDRESS18: U15.3(A18) ; port NVRAM_ADDRESS18
NVRAM_ADDRESS19: U15.35(A19) ; port NVRAM_ADDRESS19
NVRAM_ADDRESS20: U15.2(A20) ; port NVRAM_ADDRESS20
NVRAM_CE: U15.24(/CE) ; port NVRAM_CE
NVRAM_DATA0: U15.15(DQ0) ; port NVRAM_DATA0
NVRAM_DATA1: U15.16(DQ1) ; port NVRAM_DATA1
NVRAM_DATA2: U15.17(DQ2) ; port NVRAM_DATA2
NVRAM_DATA3: U15.19(DQ3) ; port NVRAM_DATA3
NVRAM_DATA4: U15.20(DQ4) ; port NVRAM_DATA4
NVRAM_DATA5: U15.21(DQ5) ; port NVRAM_DATA5
NVRAM_DATA6: U15.22(DQ6) ; port NVRAM_DATA6
NVRAM_DATA7: U15.23(DQ7) ; port NVRAM_DATA7
NVRAM_OE: U15.26(/OE) ; port NVRAM_OE
NVRAM_RST: U16.3(RESET) ; port NVRAM_RST
NVRAM_WE: U15.31(/WE) ; port NVRAM_WE
NetC49_1: C49.1 U16.4(/MR)

Not connected (* = marked no-connect by the designer): U15 1(NC) 34(NC)

### Notes on the sheet
- 6
- 5
- 4
- 3
- 2
- 1
- LTR
- ECO NO:
- REVISION RECORD
- APPROVED:
- DATE:
- D
- C
- GND
- B
- COMPANY:
- A
- TITLE:
- DRAWN:
- DATED:
- CHECKED:
- CODE:
- SIZE:
- DRAWING NO:
- REV:
- QUALITY CONTROL:
- RELEASED:
- SCALE:
- SHEET: OF

### Library data of the parts
C9 C13 C46 C49 = C: as C1 on sheet MAX_BUS; PCB DECAL: SM/C_0805
U15 = DS1265W: Source_Path: E:\MILOS\PROJECTS\ATLAS_XP2V3\DALLAS.OLB; PCB DECAL: DIP.100/36/W.600/L1.850; Value: DS1265W
U16 = MAX825_T: Source_Path: E:\MILOS\PROJECTS\ATLAS_XP2V3\ATLASXP.OLB; PCB DECAL: SOT23_5_MILOS_REV4; Value: MAX825_T